# EAGLE schematic main_smd_first_draft (EAGLE 9.0.0)
AUTHOR: Mel McCalla; REV: 0.1

## Sheet 1 of 9: Microcontroller, Screen, JTAG, Reset, Encoder
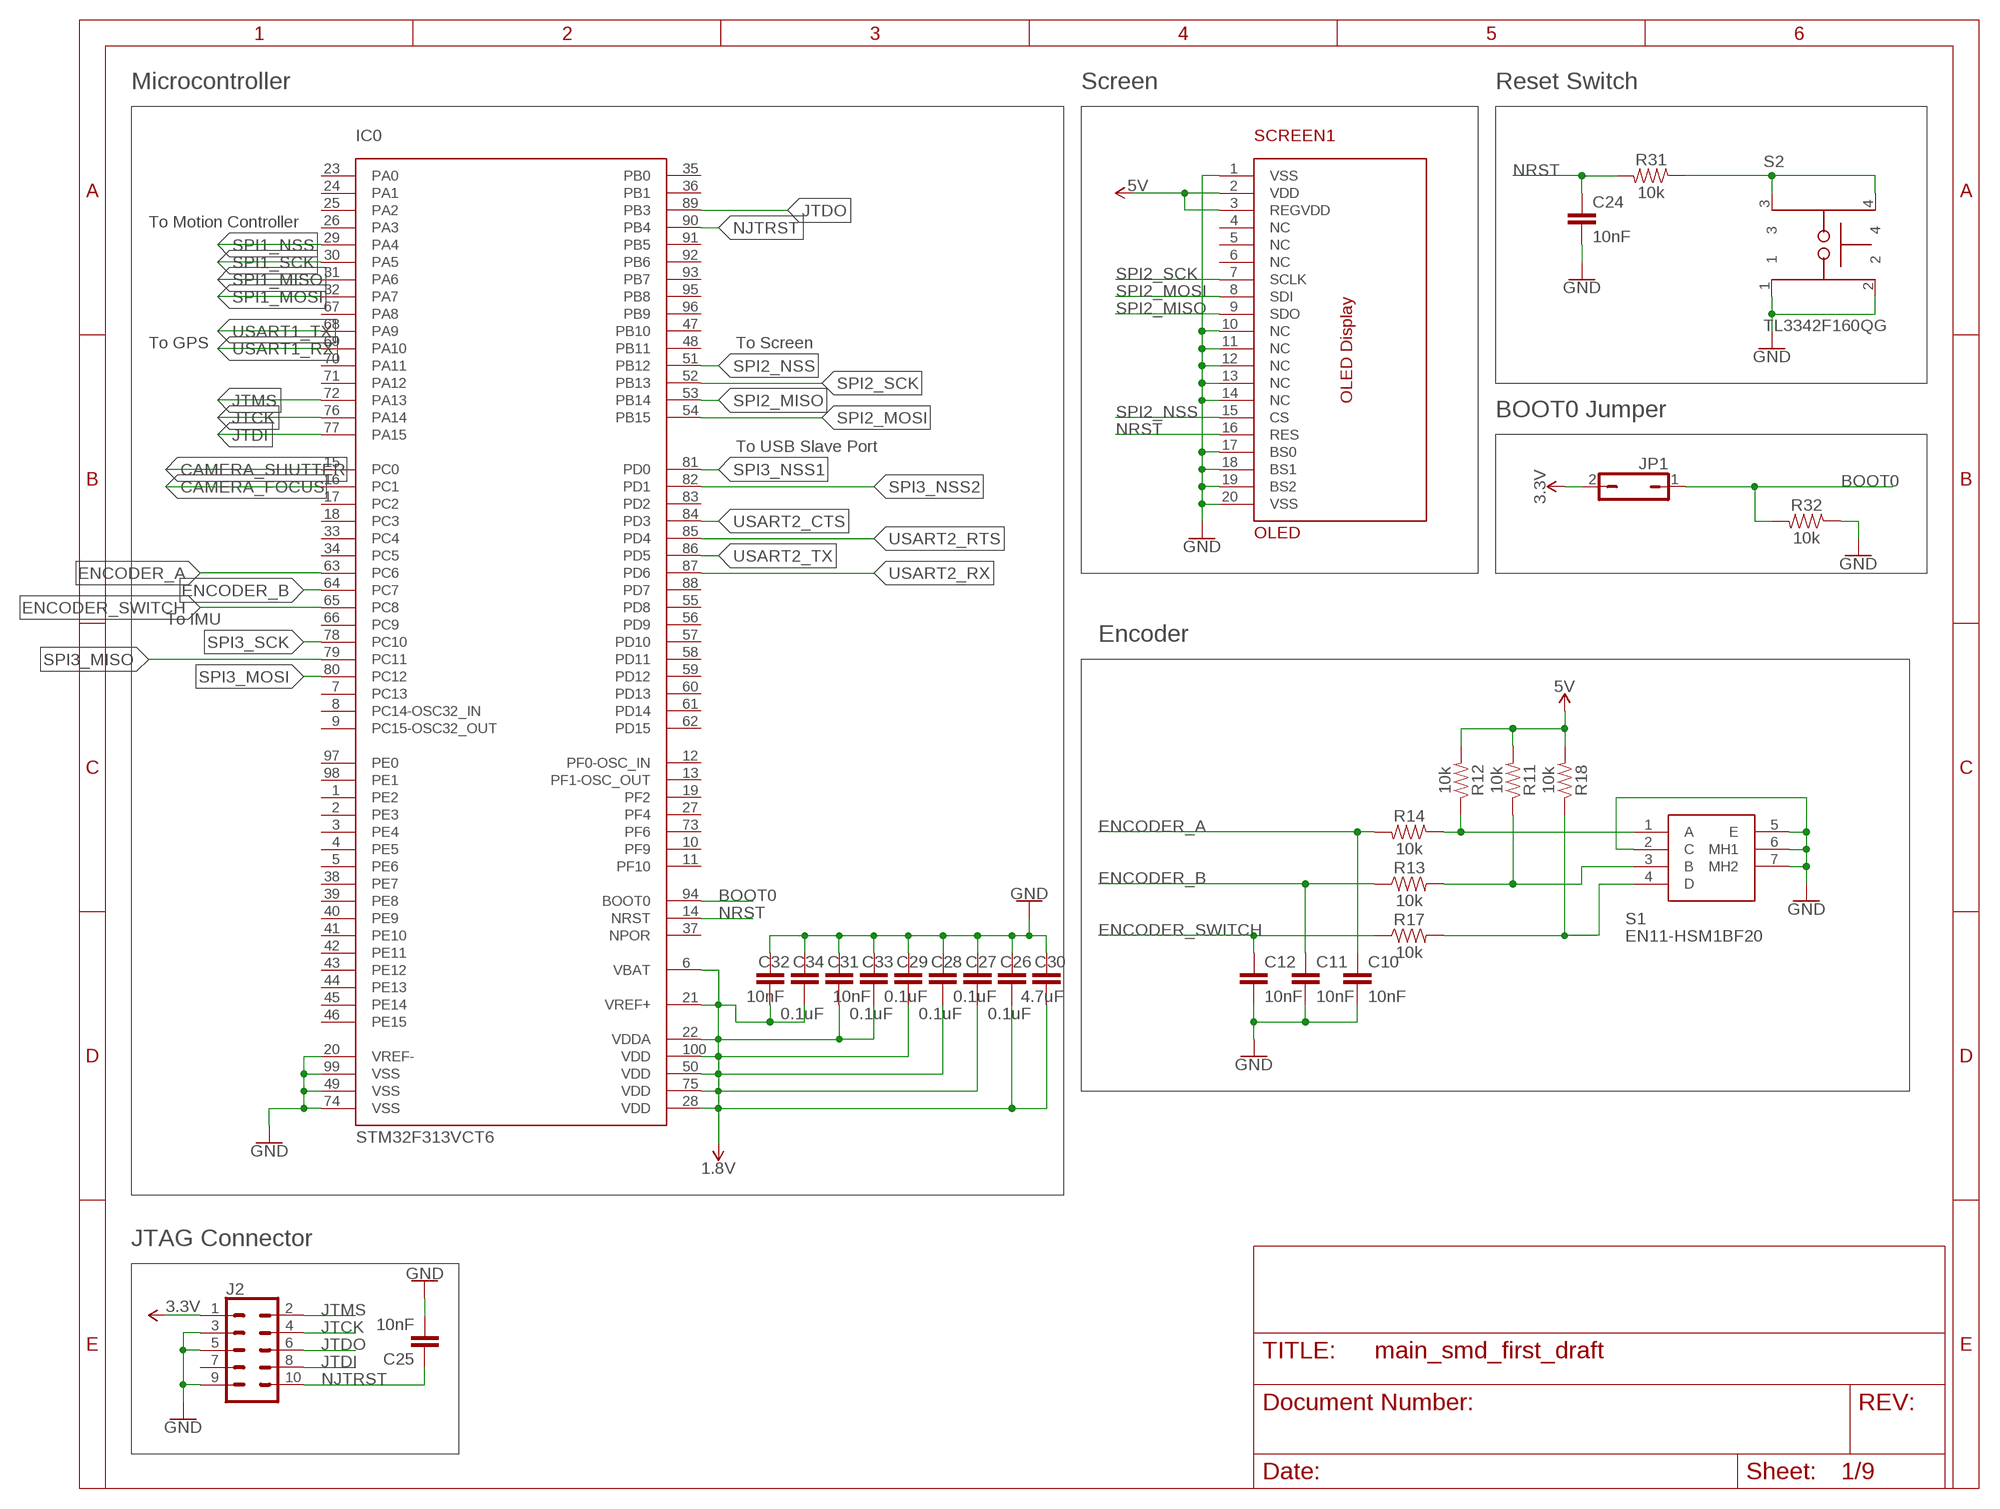
[diagram p0: schematic, sheet 1]

### Parts
C10  10nF  10NF-0603-50V-10%  [0603]
C11  10nF  10NF-0603-50V-10%  [0603]
C12  10nF  10NF-0603-50V-10%  [0603]
C24  10nF  10NF-0603-50V-10%  [0603]
C25  10nF  10NF-0603-50V-10%  [0603]
C26  0.1uF  0.1UF-0402-16V-10%  [0402]
C27  0.1uF  0.1UF-0402-16V-10%  [0402]
C28  0.1uF  0.1UF-0402-16V-10%  [0402]
C29  0.1uF  0.1UF-0402-16V-10%  [0402]
C30  4.7uF  4.7UF0603  [0603]
C31  10nF  10NF-0603-50V-10%  [0603]
C32  10nF  10NF-0603-50V-10%  [0603]
C33  0.1uF  0.1UF-0603-25V-(+80/-20%)  [0603]
C34  0.1uF  0.1UF-0603-25V-(+80/-20%)  [0603]
IC0  STM32F313VCT6  [QFP50P1600X1600X160-100N]
J2  CONN_05X2SHD_LOCK  [2X5-SHROUDED_LOCK]
JP1  JP1Q  [JP1]
R11  10k  10KOHM-0603-1/10W-1%  [0603]
R12  10k  10KOHM-0603-1/10W-1%  [0603]
R13  10k  10KOHM-0603-1/10W-1%  [0603]
R14  10k  10KOHM-0603-1/10W-1%  [0603]
R17  10k  10KOHM-0603-1/10W-1%  [0603]
R18  10k  10KOHM-0603-1/10W-1%  [0603]
R31  10k  10KOHM-0603-1/10W-1%  [0603]
R32  10k  10KOHM-0603-1/10W-1%  [0603]
S1  EN11-HSM1BF20  [EN11HSM1BF20]
S2  TL3342F160QG  [SW_TL3342F160QG]
SCREEN1  OLED  [SIP-20]

### Nets
1.8V [power]: C26.1 C27.1 C28.1 C29.1 C30.1 C31.2 C32.2 C33.2 C34.2 IC0.6(VBAT) IC0.21(VREF+) IC0.22(VDDA) IC0.28(VDD) IC0.50(VDD) IC0.75(VDD) IC0.100(VDD) ; also sheet 2,3
3.3V [power]: J2.1 JP1.2 ; also sheet 2,3,4,5,6,7,8,9
5V [power]: R11.2 R12.2 R18.2 SCREEN1.2(VDD) SCREEN1.3(REGVDD) ; also sheet 2,3,5,6,7,8
BOOT0: IC0.94(BOOT0) JP1.1 R32.2
CAMERA_FOCUS: IC0.16(PC1) ; also sheet 2
CAMERA_SHUTTER: IC0.15(PC0) ; also sheet 2
ENCODER_A: C10.1 IC0.63(PC6) R14.2
ENCODER_B: C11.1 IC0.64(PC7) R13.1
ENCODER_SWITCH: C12.1 IC0.65(PC8) R17.1
GND [ground]: C10.2 C11.2 C12.2 C24.2 C25.2 C26.2 C27.2 C28.2 C29.2 C30.2 C31.1 C32.1 C33.1 C34.1 IC0.20(VREF-) IC0.49(VSS) IC0.74(VSS) IC0.99(VSS) J2.3 J2.5 J2.9 R32.1 S1.2(C) S1.5(E) S1.6(MH1) S1.7(MH2) S2.1 S2.2 SCREEN1.1(VSS) SCREEN1.10(NC) SCREEN1.11(NC) SCREEN1.12(NC) SCREEN1.13(NC) SCREEN1.14(NC) SCREEN1.17(BS0) SCREEN1.18(BS1) SCREEN1.19(BS2) SCREEN1.20(VSS) ; also sheet 2,3,4,5,6,7,8,9
JTCK: IC0.76(PA14) J2.4
JTDI: IC0.77(PA15) J2.8
JTDO: IC0.89(PB3) J2.6
JTMS: IC0.72(PA13) J2.2
N$19: R17.2 R18.1 S1.4(D)
N$20: R12.1 R14.1 S1.1(A)
N$21: R11.1 R13.2 S1.3(B)
N$32: R31.1 S2.3 S2.4
NJTRST: C25.1 IC0.90(PB4) J2.10
NRST: C24.1 IC0.14(NRST) R31.2 SCREEN1.16(RES) ; also sheet 2,4
SPI1_MISO: IC0.31(PA6) ; also sheet 4
SPI1_MOSI: IC0.32(PA7) ; also sheet 4
SPI1_NSS: IC0.29(PA4) ; also sheet 4
SPI1_SCK: IC0.30(PA5) ; also sheet 4
SPI2_MISO: IC0.53(PB14) SCREEN1.9(SDO)
SPI2_MOSI: IC0.54(PB15) SCREEN1.8(SDI)
SPI2_NSS: IC0.51(PB12) SCREEN1.15(CS)
SPI2_SCK: IC0.52(PB13) SCREEN1.7(SCLK)
SPI3_MISO: IC0.79(PC11) ; also sheet 9
SPI3_MOSI: IC0.80(PC12) ; also sheet 9
SPI3_NSS1: IC0.81(PD0) ; also sheet 9
SPI3_NSS2: IC0.82(PD1) ; also sheet 9
SPI3_SCK: IC0.78(PC10) ; also sheet 9
USART1_RX: IC0.69(PA10) ; also sheet 9
USART1_TX: IC0.68(PA9) ; also sheet 9
USART2_CTS: IC0.84(PD3) ; also sheet 2
USART2_RTS: IC0.85(PD4) ; also sheet 2
USART2_RX: IC0.87(PD6) ; also sheet 2
USART2_TX: IC0.86(PD5) ; also sheet 2
Unconnected: IC0.1(PE2) IC0.2(PE3) IC0.3(PE4) IC0.4(PE5) IC0.5(PE6) IC0.7(PC13) IC0.8(PC14-OSC32_IN) IC0.9(PC15-OSC32_OUT) IC0.10(PF9) IC0.11(PF10) IC0.12(PF0-OSC_IN) IC0.13(PF1-OSC_OUT) IC0.17(PC2) IC0.18(PC3) IC0.19(PF2) IC0.23(PA0) IC0.24(PA1) IC0.25(PA2) IC0.26(PA3) IC0.27(PF4) IC0.33(PC4) IC0.34(PC5) IC0.35(PB0) IC0.36(PB1) IC0.37(NPOR) IC0.38(PE7) IC0.39(PE8) IC0.40(PE9) IC0.41(PE10) IC0.42(PE11) IC0.43(PE12) IC0.44(PE13) IC0.45(PE14) IC0.46(PE15) IC0.47(PB10) IC0.48(PB11) IC0.55(PD8) IC0.56(PD9) IC0.57(PD10) IC0.58(PD11) IC0.59(PD12) IC0.60(PD13) IC0.61(PD14) IC0.62(PD15) IC0.66(PC9) IC0.67(PA8) IC0.70(PA11) IC0.71(PA12) IC0.73(PF6) IC0.83(PD2) IC0.88(PD7) IC0.91(PB5) IC0.92(PB6) IC0.93(PB7) IC0.95(PB8) IC0.96(PB9) IC0.97(PE0) IC0.98(PE1) J2.7 SCREEN1.4(NC) SCREEN1.5(NC) SCREEN1.6(NC)

### Notes on the sheet
- Microcontroller | Screen | Reset Switch
- To Motion Controller
- To GPS | To Screen
- BOOT0 Jumper
- To USB Slave Port
- To IMU
- Encoder
- JTAG Connector

## Sheet 2 of 9: Camera Control, USB Controller, USB C Port
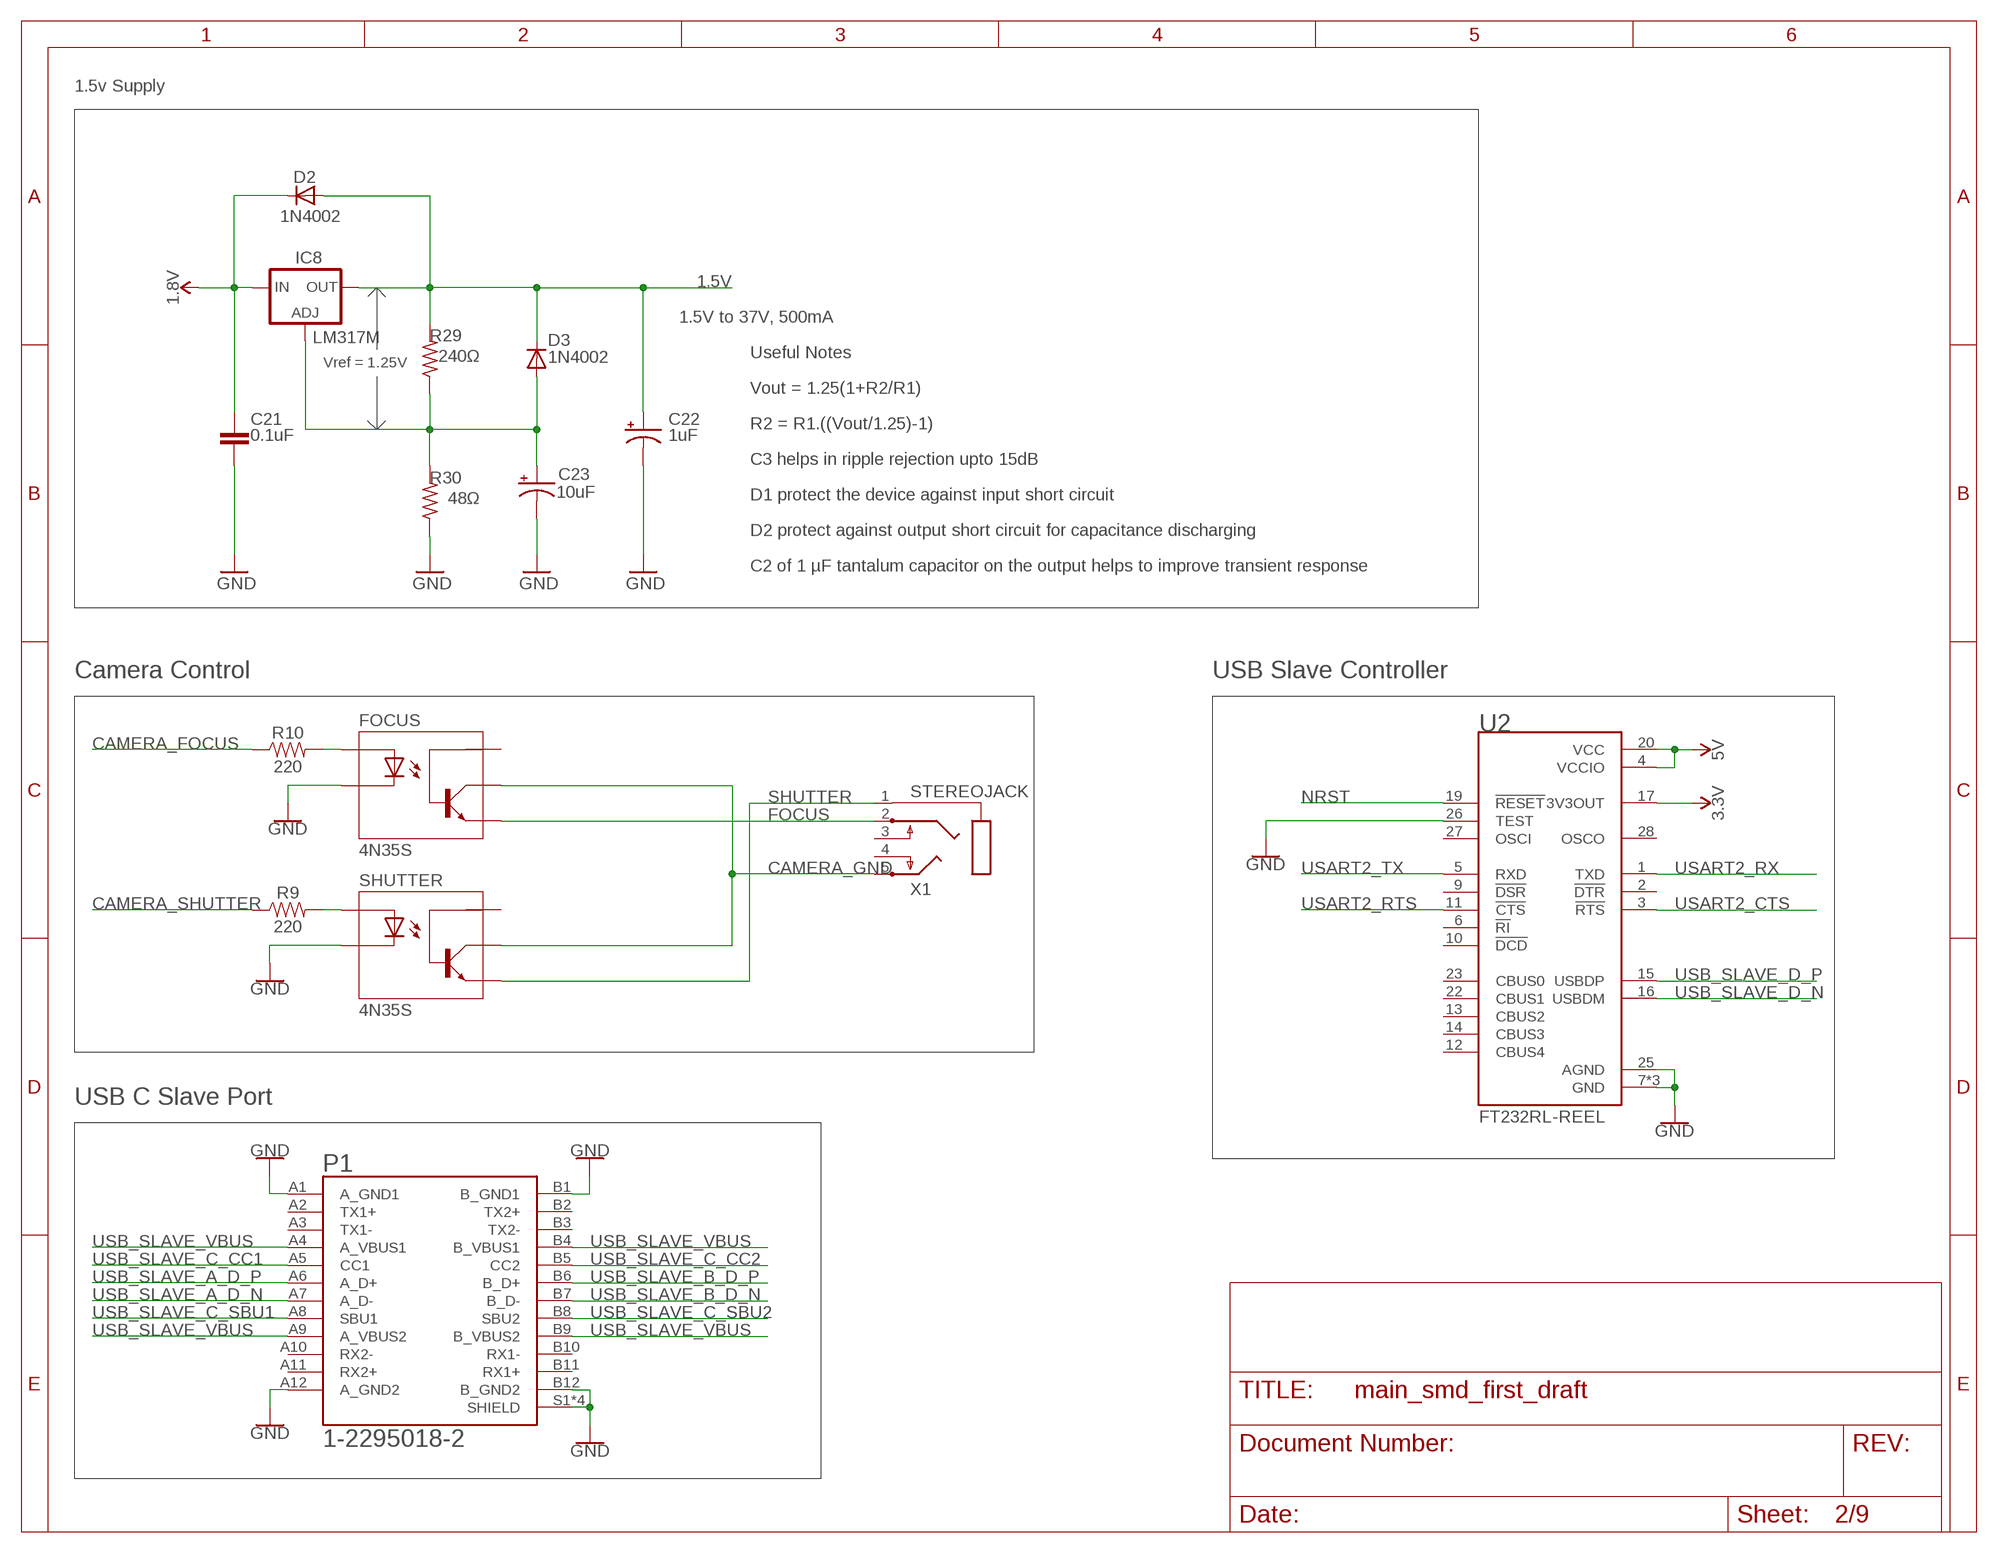
[diagram p1: schematic, sheet 2]

### Parts
C21  0.1uF  C-EU075-052X106  [C075-052X106]
C22  1uF  CPOL-US085CS-1AR  [085CS_1AR]
C23  10uF  CPOL-US085CS-1AR  [085CS_1AR]
D2  1N4002  1N4004  [DO41-10]
D3  1N4002  1N4004  [DO41-10]
FOCUS  4N35S  [SOT23-6]
IC8  LM317MBSTT3  [SOT223]
P1  1-2295018-2  [TE_1-2295018-2]
R9  220  220OHM-0603-1/10W-1%  [0603]
R10  220  220OHM-0603-1/10W-1%  [0603]
R29  240Ω  R-US_M0805  [M0805]
R30  48Ω  R-US_M0805  [M0805]
SHUTTER  4N35S  [SOT23-6]
U2  FT232RL-REEL  [SOP65P780X200-28N]
X1  STEREOJACK  [STX3100]

### Nets
1.5V: C22.+ D2.A D3.C IC8.4(OUT) R29.2 ; also sheet 4
1.8V [power]: C21.1 D2.C IC8.3(IN) ; also sheet 1,3
3.3V [power]: U2.17(3V3OUT) ; also sheet 1,3,4,5,6,7,8,9
5V [power]: U2.4(VCCIO) U2.20(VCC) ; also sheet 1,3,5,6,7,8
CAMERA_FOCUS: R10.1 ; also sheet 1
CAMERA_GND: FOCUS.5 SHUTTER.5 X1.5
CAMERA_SHUTTER: R9.1 ; also sheet 1
FOCUS: FOCUS.4 X1.2
GND [ground]: C21.2 C22.- C23.- FOCUS.2 P1.A1(A_GND1) P1.A12(A_GND2) P1.B1(B_GND1) P1.B12(B_GND2) P1.S1(SHIELD) P1.S2(SHIELD) P1.S3(SHIELD) P1.S4(SHIELD) R30.1 SHUTTER.2 U2.7(GND) U2.18(GND) U2.21(GND) U2.25(AGND) U2.26(TEST) ; also sheet 1,3,4,5,6,7,8,9
N$17: FOCUS.1 R10.2
N$18: R9.2 SHUTTER.1
N$30: C23.+ D3.A IC8.1(ADJ) R29.1 R30.2
NRST: U2.19(!RESET) ; also sheet 1,4
SHUTTER: SHUTTER.4 X1.1
USART2_CTS: U2.3(!RTS) ; also sheet 1
USART2_RTS: U2.11(!CTS) ; also sheet 1
USART2_RX: U2.1(TXD) ; also sheet 1
USART2_TX: U2.5(RXD) ; also sheet 1
USB_SLAVE_A_D_N [differential]: P1.A7(A_D-) ; also sheet 3
USB_SLAVE_A_D_P [differential]: P1.A6(A_D+) ; also sheet 3
USB_SLAVE_B_D_N [differential]: P1.B7(B_D-) ; also sheet 3
USB_SLAVE_B_D_P [differential]: P1.B6(B_D+) ; also sheet 3
USB_SLAVE_C_CC1: P1.A5(CC1) ; also sheet 3
USB_SLAVE_C_CC2: P1.B5(CC2) ; also sheet 3
USB_SLAVE_C_SBU1: P1.A8(SBU1) ; also sheet 3
USB_SLAVE_C_SBU2: P1.B8(SBU2) ; also sheet 3
USB_SLAVE_D_N [differential]: U2.16(USBDM) ; also sheet 3
USB_SLAVE_D_P [differential]: U2.15(USBDP) ; also sheet 3
USB_SLAVE_VBUS: P1.A4(A_VBUS1) P1.A9(A_VBUS2) P1.B4(B_VBUS1) P1.B9(B_VBUS2)
Unconnected: FOCUS.6 P1.A2(TX1+) P1.A3(TX1-) P1.A10(RX2-) P1.A11(RX2+) P1.B2(TX2+) P1.B3(TX2-) P1.B10(RX1-) P1.B11(RX1+) SHUTTER.6 U2.2(!DTR) U2.6(!RI) U2.9(!DSR) U2.10(!DCD) U2.12(CBUS4) U2.13(CBUS2) U2.14(CBUS3) U2.22(CBUS1) U2.23(CBUS0) U2.27(OSCI) U2.28(OSCO) X1.3 X1.4

### Notes on the sheet
- 1.5v Supply
- 1.5V to 37V, 500mA
- Useful Notes
- Vref = 1.25V
- Vout = 1.25(1+R2/R1)
- R2 = R1.((Vout/1.25)-1)
- C3 helps in ripple rejection upto 15dB
- D1 protect the device against input short circuit
- D2 protect against output short circuit for capacitance discharging
- C2 of 1 µF tantalum capacitor on the output helps to improve transient response
- Camera Control | USB Slave Controller
- USB C Slave Port

## Sheet 3 of 9: USB C Multiplexer, USB C ESD, Power Input
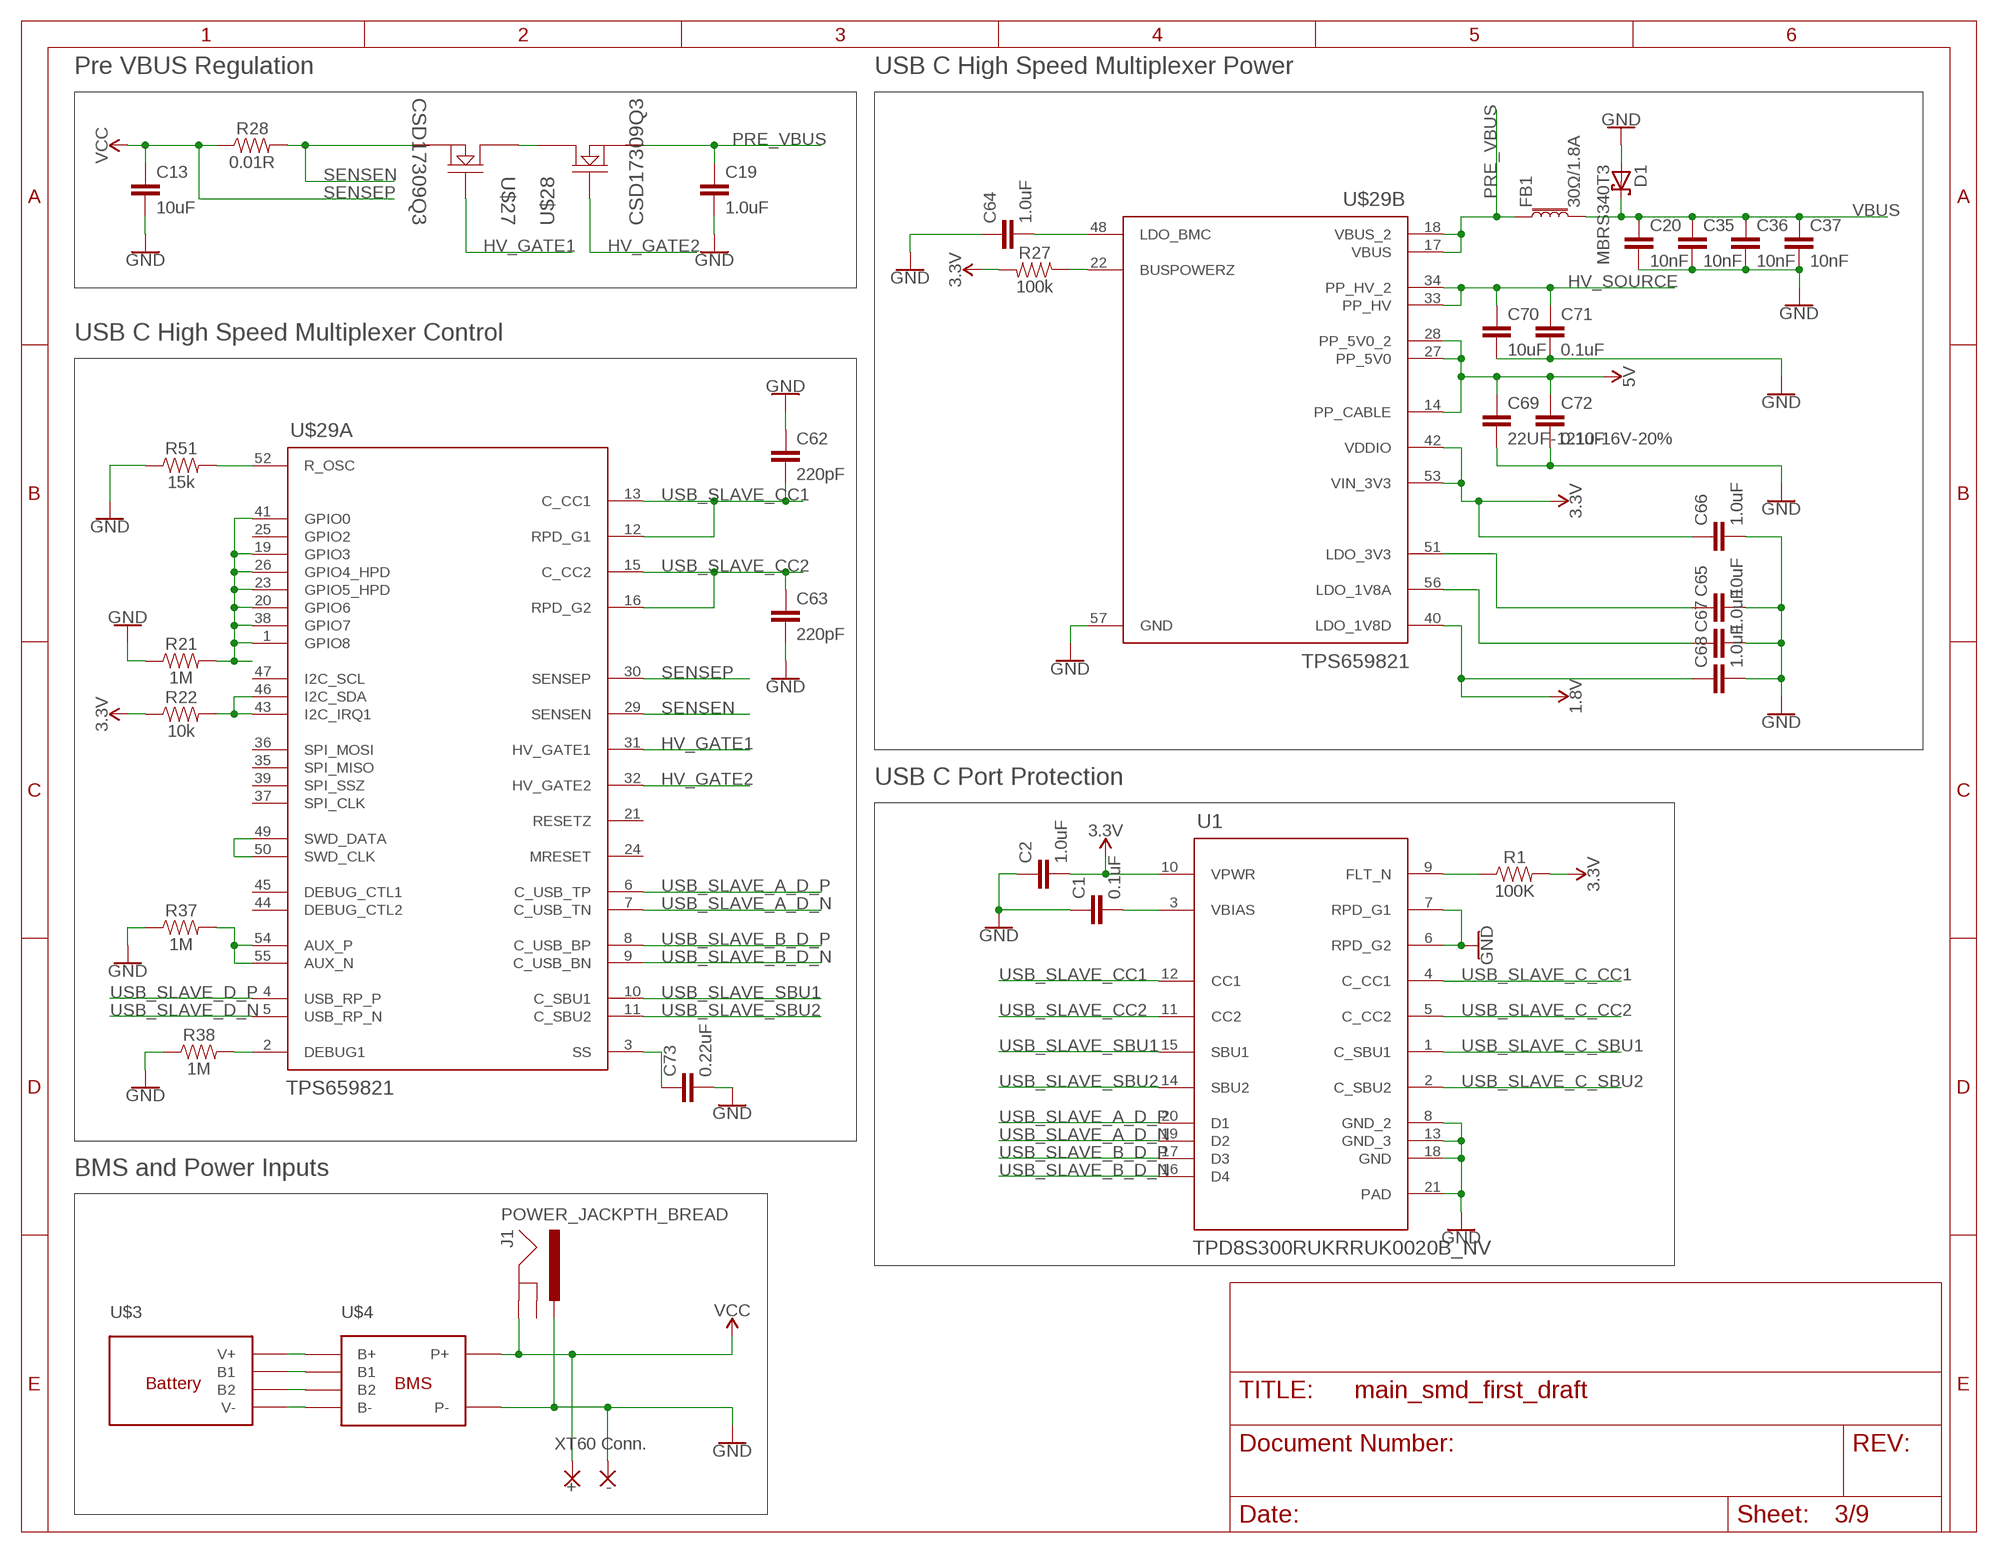
[diagram p2: schematic, sheet 3]

### Parts
+  3,81/1,1  [3,81/1,1]
-  3,81/1,1  [3,81/1,1]
C1  0.1uF  0.1UF-0603-100V-10%  [0603]
C2  1.0uF  1.0UF-0603-16V-10%  [0603]
C13  10uF  10UF-1210-50V-20%  [1210]
C19  1.0uF  1.0UF-1206-50V-10%  [1206]
C20  10nF  10NF-0603-50V-10%  [0603]
C35  10nF  10NF-0603-50V-10%  [0603]
C36  10nF  10NF-0603-50V-10%  [0603]
C37  10nF  10NF-0603-50V-10%  [0603]
C62  220pF  C-EUC0402  [C0402]
C63  220pF  C-EUC0402  [C0402]
C64  1.0uF  1.0UF-1206-50V-10%  [1206]
C65  10uF  10UF-1210-50V-20%  [1210]
C66  1.0uF  1.0UF-1206-50V-10%  [1206]
C67  1.0uF  1.0UF-1206-50V-10%  [1206]
C68  1.0uF  1.0UF-1206-50V-10%  [1206]
C69  22UF-1210-16V-20%  [1210]
C70  10uF  10UF-1210-50V-20%  [1210]
C71  0.1uF  0.1UF-0603-25V-5%  [0603]
C72  0.1uF  0.1UF-0603-25V-5%  [0603]
C73  0.22uF  0.22UF-0603-25V-10%  [0603]
D1  MBRS340T3  [SMC]
FB1  30Ω/1.8A  FERRITE_BEAD-0603  [0603]
J1  POWER_JACKPTH_BREAD  [POWER_JACK_PTH_BREAD]
R1  100K  100KOHM-0402-1/16W-1%  [0402]
R21  1M  1MOHM-0603-1/4W-5%  [0603]
R22  10k  10KOHM-0603-1/10W-1%  [0603]
R27  100k  100KOHM-0603-1/10W-1%  [0603]
R28  0.01R  RESISTOR0805  [0805]
R37  1M  1MOHM-0603-1/4W-5%  [0603]
R38  1M  1MOHM-0603-1/4W-5%  [0603]
R51  15k  15KOHM-0603-1/10W-1%  [0603]
U1  TPD8S300RUKRRUK0020B_NV  [RUK0020B_NV]
U$3  BATTERY  (no package)
U$4  BATTERY_MANAGEMENT_SYSTEM  (no package)
U$27  CSD17309Q3  [DQG0008A]
U$28  CSD17309Q3  [DQG0008A]
U$29  TPS659821  [QFN50P800X800X100-57N]

### Nets
1.8V [power]: C68.1 U$29.40(B:LDO_1V8D) ; also sheet 1,2
3.3V [power]: C2.2 C66.1 R1.2 R22.1 R27.2 U1.10(VPWR) U$29.42(B:VDDIO) U$29.53(B:VIN_3V3) ; also sheet 1,2,4,5,6,7,8,9
5V [power]: C69.1 C72.1 U$29.14(B:PP_CABLE) U$29.27(B:PP_5V0) U$29.28(B:PP_5V0_2) ; also sheet 1,2,5,6,7,8
GND [ground]: -.1(P) C1.1 C2.1 C13.2 C19.2 C20.2 C35.2 C36.2 C37.2 C62.1 C63.2 C64.1 C65.2 C66.2 C67.2 C68.2 C69.2 C70.2 C71.2 C72.2 C73.2 D1.A J1.PWR R21.1 R37.1 R38.1 R51.1 U1.6(RPD_G2) U1.7(RPD_G1) U1.8(GND_2) U1.13(GND_3) U1.18(GND) U1.21(PAD) U$4.P- U$29.57(B:GND) ; also sheet 1,2,4,5,6,7,8,9
HV_GATE1: U$27.4(GATE) U$29.31(A:HV_GATE1)
HV_GATE2: U$28.4(GATE) U$29.32(A:HV_GATE2)
HV_SOURCE [power]: C70.1 C71.1 U$29.33(B:PP_HV) U$29.34(B:PP_HV_2) ; also sheet 5
LDO_3V3 [power]: C65.1 U$29.51(B:LDO_3V3)
MEME: U$3.V+ U$4.B+
N$1: R37.2 U$29.54(A:AUX_P) U$29.55(A:AUX_N)
N$2: U$3.B1 U$4.B1
N$3: U$3.B2 U$4.B2
N$4 [power]: R27.1 U$29.22(B:BUSPOWERZ)
N$5 [power]: C64.2 U$29.48(B:LDO_BMC)
N$22: R21.2 U$29.1(A:GPIO8) U$29.19(A:GPIO3) U$29.20(A:GPIO6) U$29.23(A:GPIO5_HPD) U$29.26(A:GPIO4_HPD) U$29.38(A:GPIO7) U$29.41(A:GPIO0)
N$24: U$3.V- U$4.B-
N$28: U$27.5(DRAIN_2) U$27.6(DRAIN_2) U$27.7(DRAIN_2) U$27.8(DRAIN_2) U$28.5(DRAIN_2) U$28.6(DRAIN_2) U$28.7(DRAIN_2) U$28.8(DRAIN_2)
N$31: U$29.49(A:SWD_DATA) U$29.50(A:SWD_CLK)
N$34: R22.2 U$29.43(A:I2C_IRQ1) U$29.46(A:I2C_SDA)
N$35: R38.2 U$29.2(A:DEBUG1)
N$43: C73.1 U$29.3(A:SS)
N$45: R51.2 U$29.52(A:R_OSC)
N$52: C67.1 U$29.56(B:LDO_1V8A)
N$64 [power]: R1.1 U1.9(FLT_N)
N$66 [power]: C1.2 U1.3(VBIAS)
PRE_VBUS [power]: C19.1 FB1.1 U$28.1(SOURCE_2) U$28.2(SOURCE_2) U$28.3(SOURCE_2) U$29.17(B:VBUS) U$29.18(B:VBUS_2)
SENSEN: R28.2 U$27.1(SOURCE_2) U$27.2(SOURCE_2) U$27.3(SOURCE_2) U$29.29(A:SENSEN)
SENSEP [power]: C13.1 R28.1 U$29.30(A:SENSEP) ; supply symbol labelled VCC
USB_SLAVE_A_D_N [differential]: U1.19(D2) U$29.7(A:C_USB_TN) ; also sheet 2
USB_SLAVE_A_D_P [differential]: U1.20(D1) U$29.6(A:C_USB_TP) ; also sheet 2
USB_SLAVE_B_D_N [differential]: U1.16(D4) U$29.9(A:C_USB_BN) ; also sheet 2
USB_SLAVE_B_D_P [differential]: U1.17(D3) U$29.8(A:C_USB_BP) ; also sheet 2
USB_SLAVE_C_CC1: U1.4(C_CC1) ; also sheet 2
USB_SLAVE_C_CC2: U1.5(C_CC2) ; also sheet 2
USB_SLAVE_C_SBU1: U1.1(C_SBU1) ; also sheet 2
USB_SLAVE_C_SBU2: U1.2(C_SBU2) ; also sheet 2
USB_SLAVE_CC1: C62.2 U1.12(CC1) U$29.12(A:RPD_G1) U$29.13(A:C_CC1)
USB_SLAVE_CC2: C63.1 U1.11(CC2) U$29.15(A:C_CC2) U$29.16(A:RPD_G2)
USB_SLAVE_D_N [differential]: U$29.5(A:USB_RP_N) ; also sheet 2
USB_SLAVE_D_P [differential]: U$29.4(A:USB_RP_P) ; also sheet 2
USB_SLAVE_SBU1: U1.15(SBU1) U$29.10(A:C_SBU1)
USB_SLAVE_SBU2: U1.14(SBU2) U$29.11(A:C_SBU2)
VBUS: C20.1 C35.1 C36.1 C37.1 D1.C FB1.2
VCC: +.1(P) J1.GND U$4.P+ ; also sheet 5,6,7,8
Unconnected: J1.GNDBREAK U$29.21(A:RESETZ) U$29.24(A:MRESET) U$29.25(A:GPIO2) U$29.35(A:SPI_MISO) U$29.36(A:SPI_MOSI) U$29.37(A:SPI_CLK) U$29.39(A:SPI_SSZ) U$29.44(A:DEBUG_CTL2) U$29.45(A:DEBUG_CTL1) U$29.47(A:I2C_SCL)

### Notes on the sheet
- Pre VBUS Regulation | USB C High Speed Multiplexer Power
- USB C High Speed Multiplexer Control
- USB C Port Protection
- BMS and Power Inputs
- XT60 Conn.

## Sheet 4 of 9: Motion Control
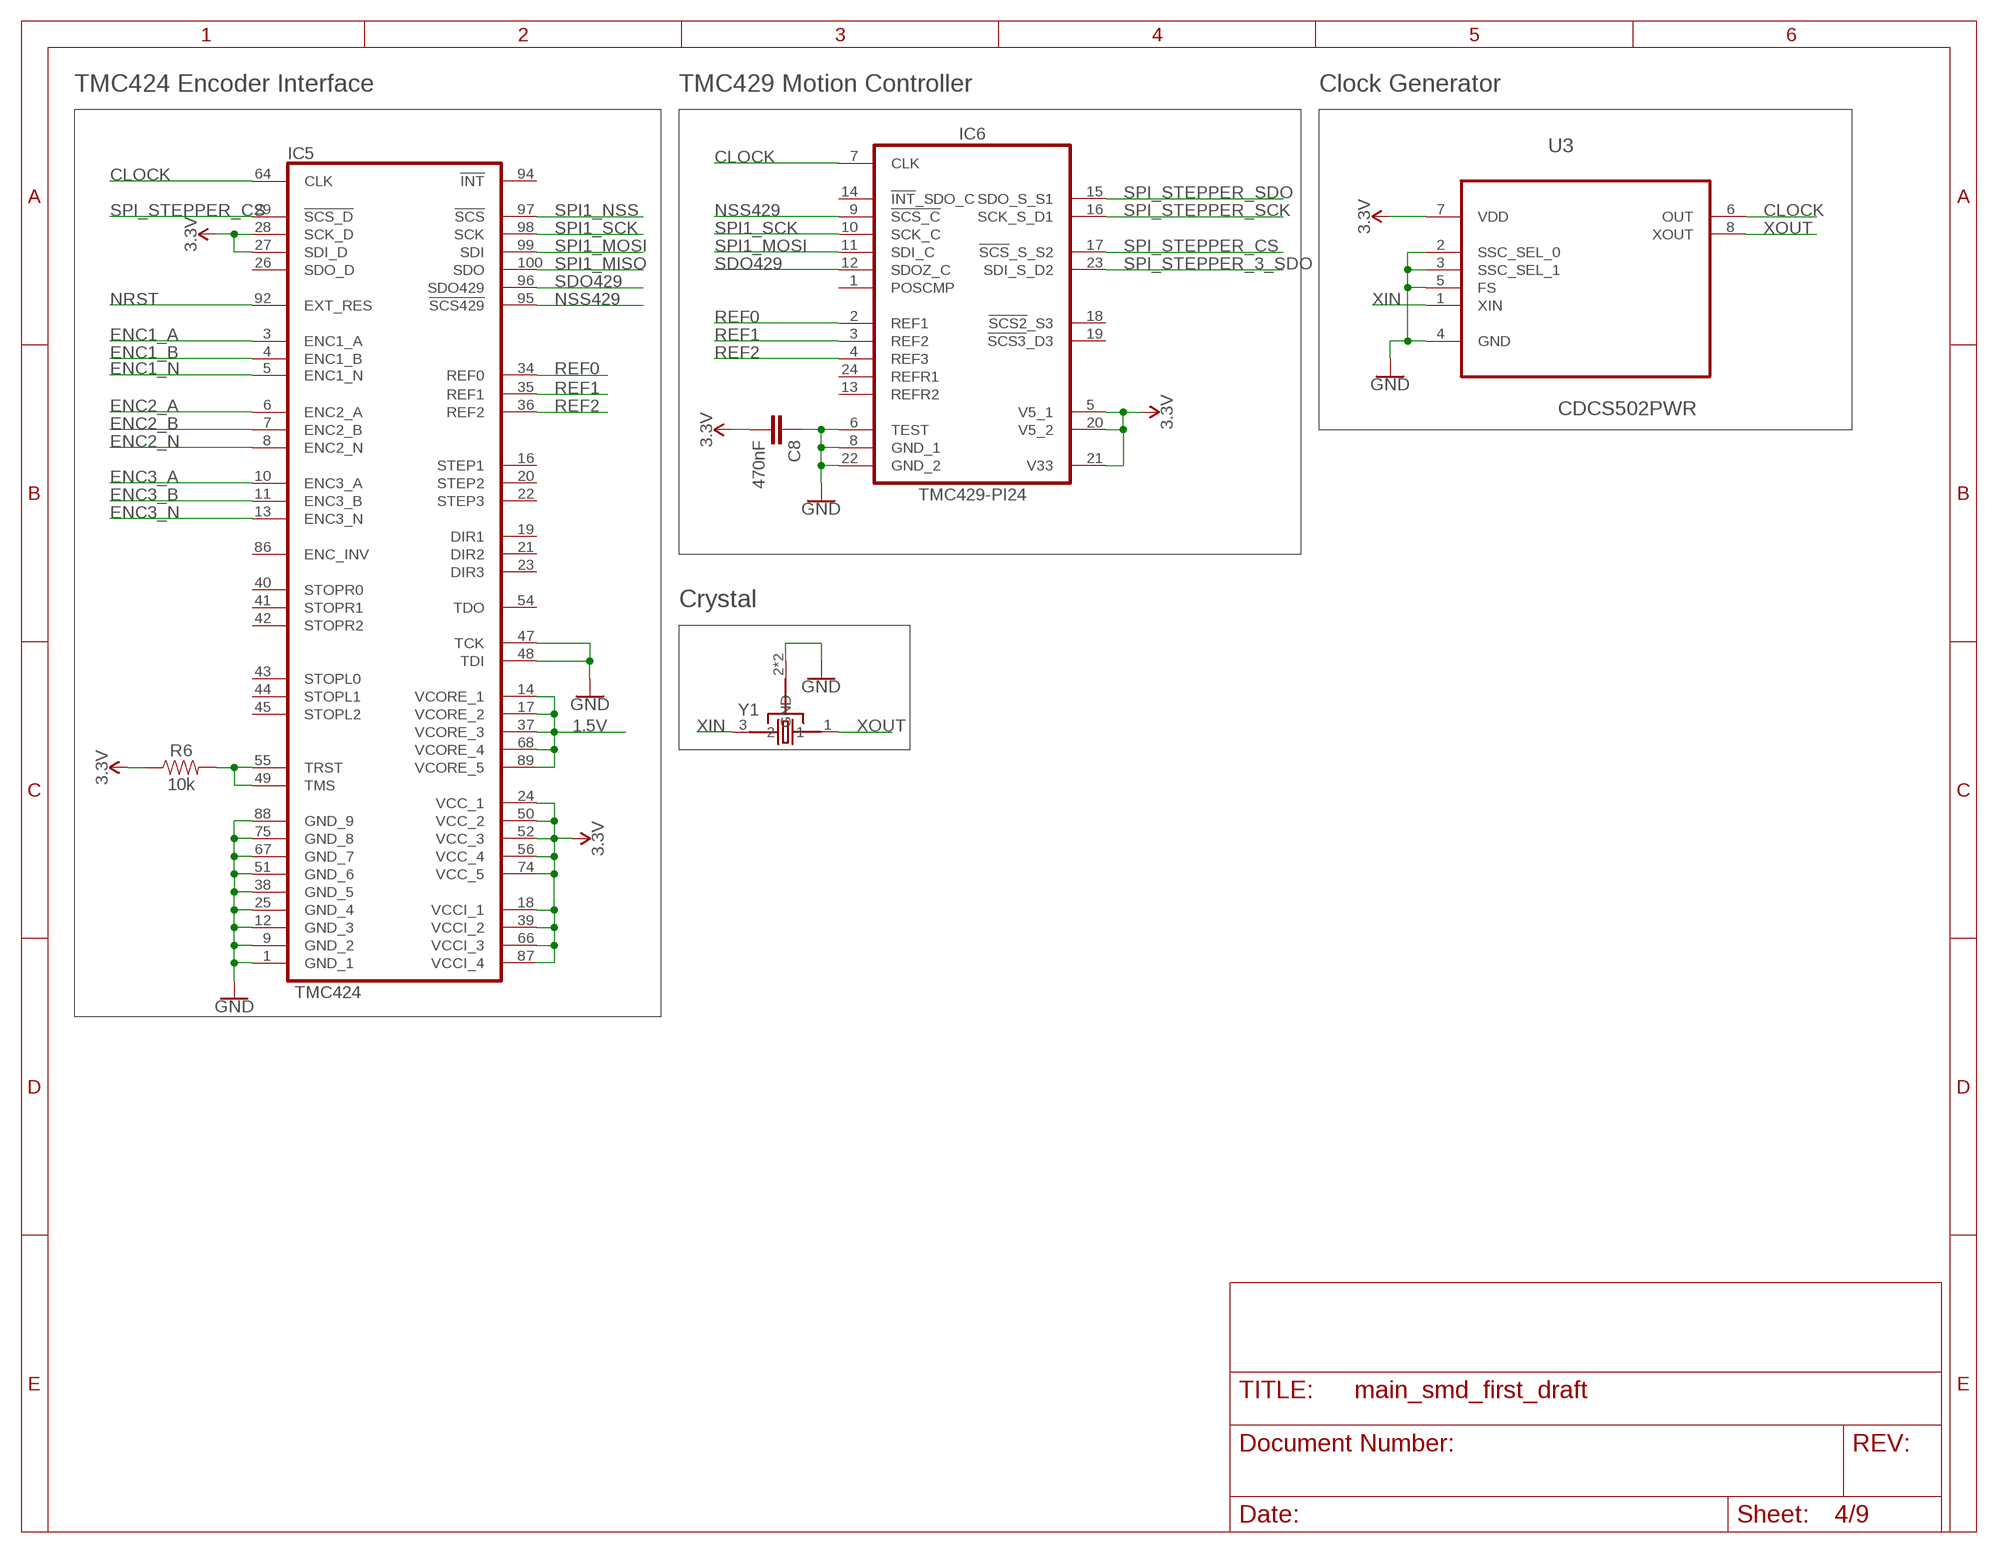
[diagram p3: schematic, sheet 4]

### Parts
C8  470nF  470NF-0402-16V-10%  [0402]
IC5  TMC424  TMC424  [TMC_TQFP100_0.5_14X14]
IC6  TMC429-PI24  TMC429-PI24  [TMC_SO24_SOT137-1_1.27_15.5X7.5]
R6  10k  10KOHM-0603-1/10W-1%  [0603]
U3  CDCS502PWR  [SOP65P640X120-8N]
Y1  7B-16.000MAAJ-T  [7B-16.000MAAJ-T_OSCSC500X320X105-4N]

### Nets
1.5V: IC5.14(VCORE_1) IC5.17(VCORE_2) IC5.37(VCORE_3) IC5.68(VCORE_4) IC5.89(VCORE_5) ; also sheet 2
3.3V [power]: C8.2 IC5.18(VCCI_1) IC5.24(VCC_1) IC5.27(SDI_D) IC5.28(SCK_D) IC5.39(VCCI_2) IC5.50(VCC_2) IC5.52(VCC_3) IC5.56(VCC_4) IC5.66(VCCI_3) IC5.74(VCC_5) IC5.87(VCCI_4) IC6.5(V5_1) IC6.20(V5_2) IC6.21(V33) R6.1 U3.7(VDD) ; also sheet 1,2,3,5,6,7,8,9
CLOCK: IC5.64(CLK) IC6.7(CLK) U3.6(OUT) ; also sheet 6,7,8
ENC1_A: IC5.3(ENC1_A) ; also sheet 6
ENC1_B: IC5.4(ENC1_B) ; also sheet 6
ENC1_N: IC5.5(ENC1_N) ; also sheet 6
ENC2_A: IC5.6(ENC2_A) ; also sheet 7
ENC2_B: IC5.7(ENC2_B) ; also sheet 7
ENC2_N: IC5.8(ENC2_N) ; also sheet 7
ENC3_A: IC5.10(ENC3_A) ; also sheet 8
ENC3_B: IC5.11(ENC3_B) ; also sheet 8
ENC3_N: IC5.13(ENC3_N) ; also sheet 8
GND [ground]: C8.1 IC5.1(GND_1) IC5.9(GND_2) IC5.12(GND_3) IC5.25(GND_4) IC5.38(GND_5) IC5.47(TCK) IC5.48(TDI) IC5.51(GND_6) IC5.67(GND_7) IC5.75(GND_8) IC5.88(GND_9) IC6.6(TEST) IC6.8(GND_1) IC6.22(GND_2) U3.2(SSC_SEL_0) U3.3(SSC_SEL_1) U3.4(GND) U3.5(FS) Y1.2(GND) Y1.4(GND) ; also sheet 1,2,3,5,6,7,8,9
N$25: IC5.49(TMS) IC5.55(TRST) R6.2
NRST: IC5.92(EXT_RES) ; also sheet 1,2
NSS429: IC5.95(!SCS429) IC6.9(!SCS_C)
REF0: IC5.34(REF0) IC6.2(REF1)
REF1: IC5.35(REF1) IC6.3(REF2)
REF2: IC5.36(REF2) IC6.4(REF3)
SDO429: IC5.96(SDO429) IC6.12(SDOZ_C)
SPI1_MISO: IC5.100(SDO) ; also sheet 1
SPI1_MOSI: IC5.99(SDI) IC6.11(SDI_C) ; also sheet 1
SPI1_NSS: IC5.97(!SCS) ; also sheet 1
SPI1_SCK: IC5.98(SCK) IC6.10(SCK_C) ; also sheet 1
SPI_STEPPER_3_SDO: IC6.23(SDI_S_D2) ; also sheet 8
SPI_STEPPER_CS: IC5.29(!SCS_D) IC6.17(!SCS!_S_S2) ; also sheet 6,7,8
SPI_STEPPER_SCK: IC6.16(SCK_S_D1) ; also sheet 6,7,8
SPI_STEPPER_SDO: IC6.15(SDO_S_S1) ; also sheet 6
XIN: U3.1(XIN) Y1.3
XOUT: U3.8(XOUT) Y1.1
Unconnected: IC5.16(STEP1) IC5.19(DIR1) IC5.20(STEP2) IC5.21(DIR2) IC5.22(STEP3) IC5.23(DIR3) IC5.26(SDO_D) IC5.40(STOPR0) IC5.41(STOPR1) IC5.42(STOPR2) IC5.43(STOPL0) IC5.44(STOPL1) IC5.45(STOPL2) IC5.54(TDO) IC5.86(ENC_INV) IC5.94(!INT) IC6.1(POSCMP) IC6.13(REFR2) IC6.14(!INT!_SDO_C) IC6.18(!SCS2!_S3) IC6.19(!SCS3!_D3) IC6.24(REFR1)

### Notes on the sheet
- TMC424 Encoder Interface | TMC429 Motion Controller | Clock Generator
- Crystal

## Sheet 5 of 9: Power Supply
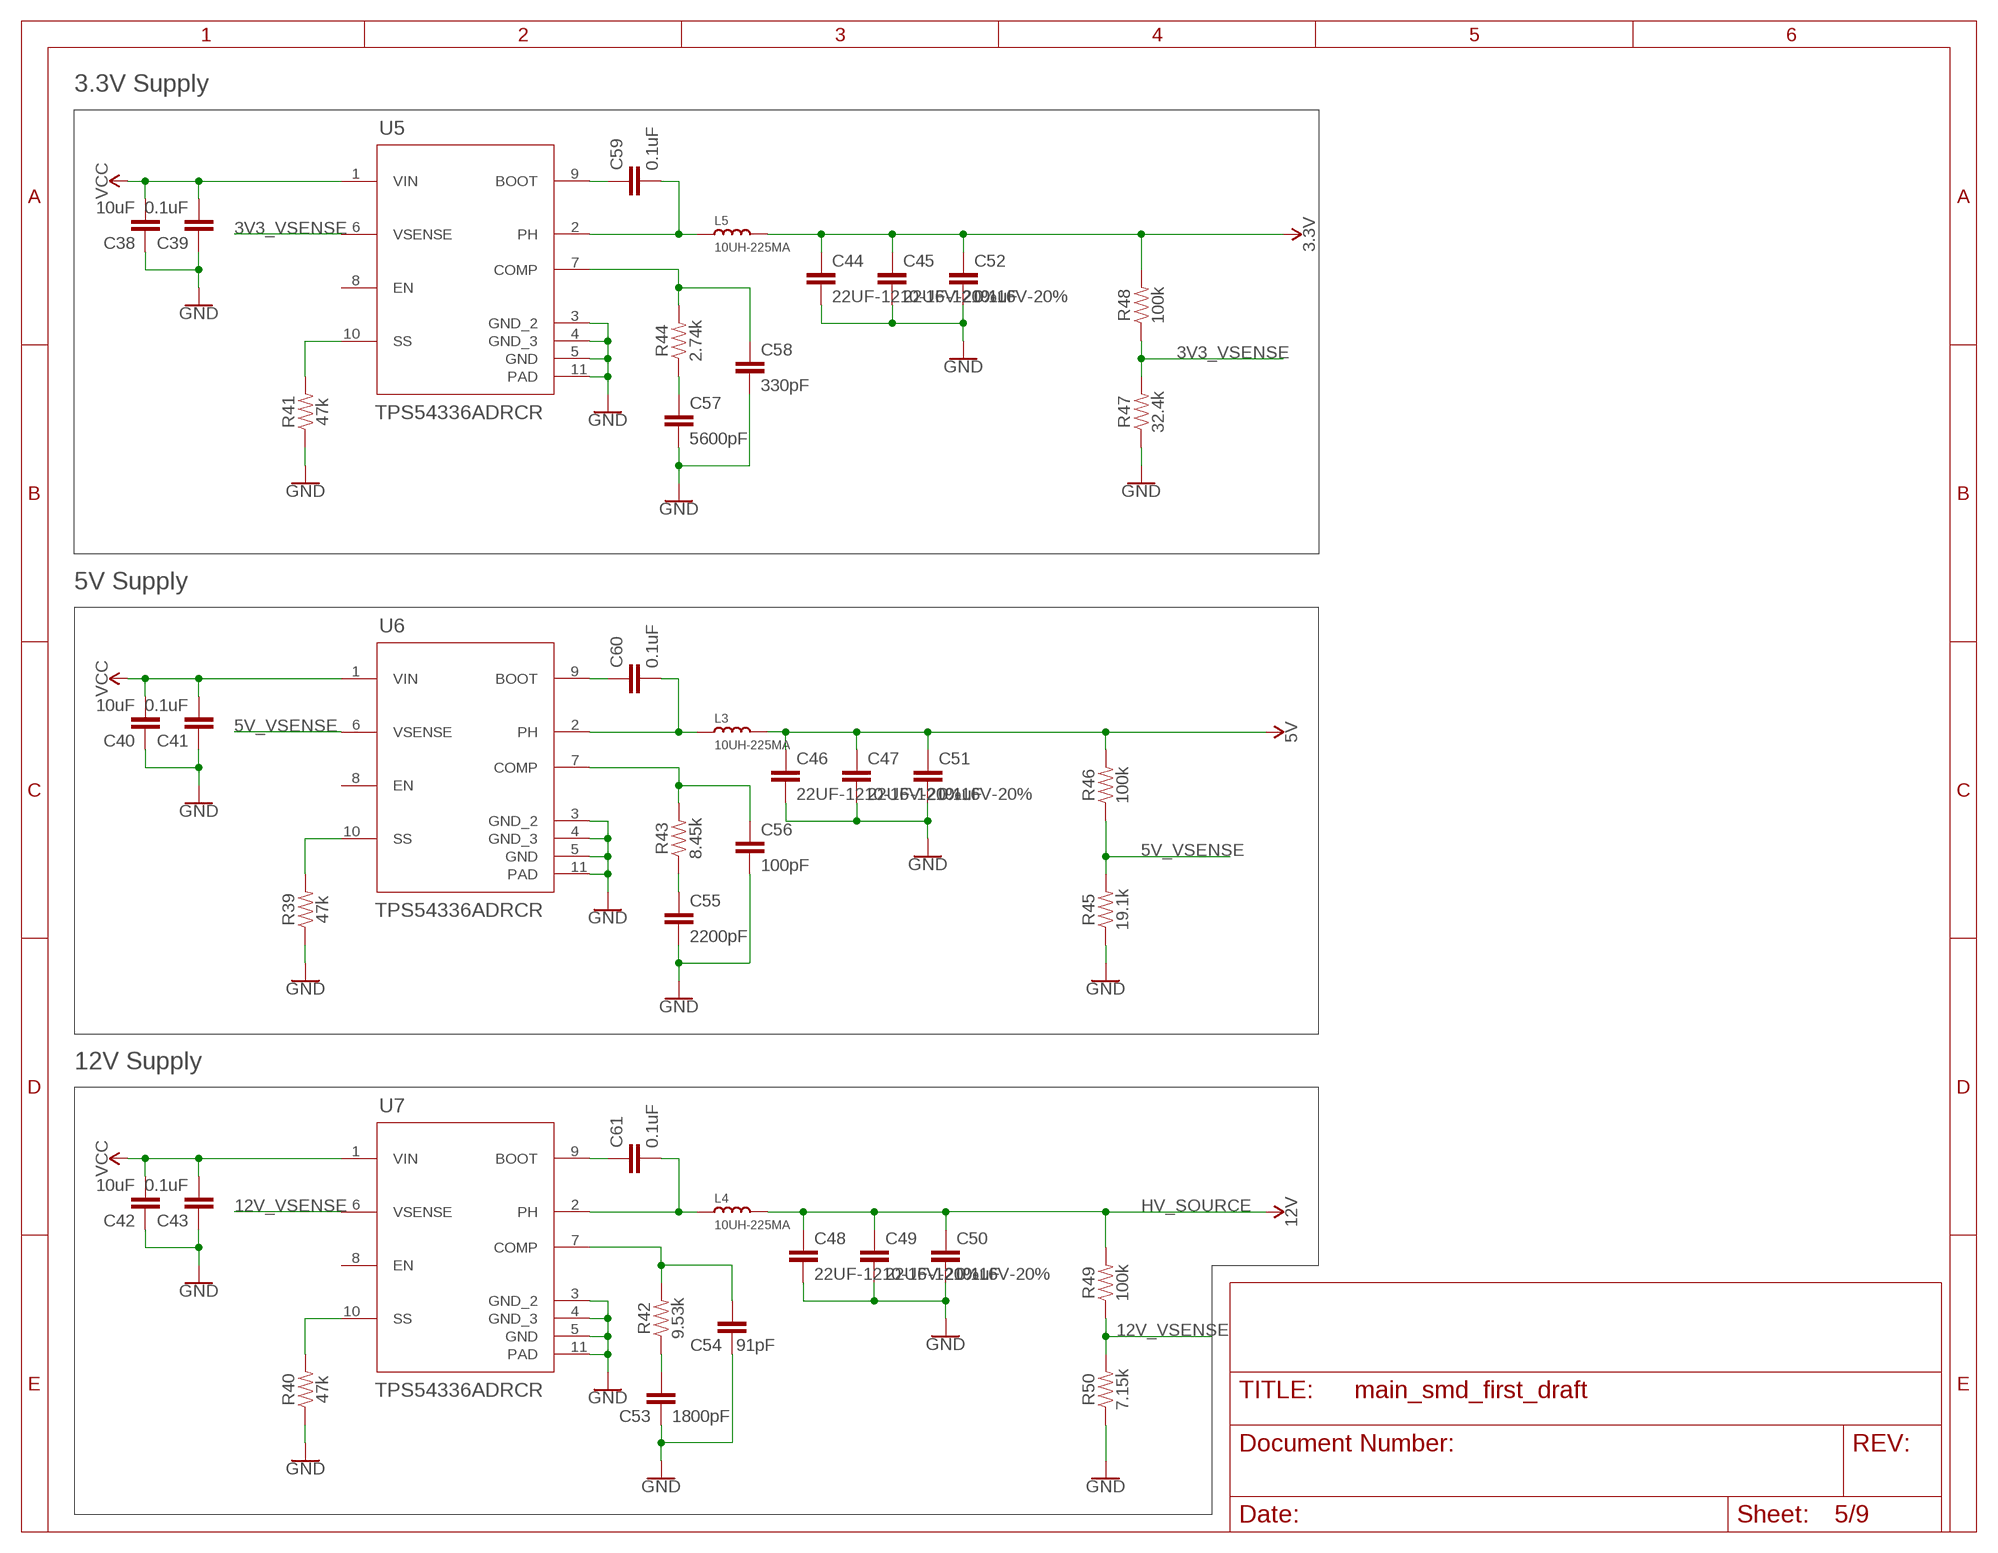
[diagram p4: schematic, sheet 5]

### Parts
C38  10uF  10UF-1210-50V-20%  [1210]
C39  0.1uF  0.1UF-0603-100V-10%  [0603]
C40  10uF  10UF-1210-50V-20%  [1210]
C41  0.1uF  0.1UF-0603-100V-10%  [0603]
C42  10uF  10UF-1210-50V-20%  [1210]
C43  0.1uF  0.1UF-0603-100V-10%  [0603]
C44  22UF-1210-16V-20%  [1210]
C45  22UF-1210-16V-20%  [1210]
C46  22UF-1210-16V-20%  [1210]
C47  22UF-1210-16V-20%  [1210]
C48  22UF-1210-16V-20%  [1210]
C49  22UF-1210-16V-20%  [1210]
C50  0.1uF  0.1UF-0402-16V-10%  [0402]
C51  0.1uF  0.1UF-0402-16V-10%  [0402]
C52  0.1uF  0.1UF-0402-16V-10%  [0402]
C53  1800pF  C-EUC0402  [C0402]
C54  91pF  C-EUC0402  [C0402]
C55  2200pF  C-EUC0402  [C0402]
C56  100pF  C-EUC0402  [C0402]
C57  5600pF  C-EUC0402  [C0402]
C58  330pF  C-EUC0402  [C0402]
C59  0.1uF  0.1UF-0603-25V-5%  [0603]
C60  0.1uF  0.1UF-0603-25V-5%  [0603]
C61  0.1uF  0.1UF-0603-25V-5%  [0603]
L3  10UH-225MA  SMD-INDUCTOR-10UH-225MA-10%(0806)  [L0806]
L4  10UH-225MA  SMD-INDUCTOR-10UH-225MA-10%(0806)  [L0806]
L5  10UH-225MA  SMD-INDUCTOR-10UH-225MA-10%(0806)  [L0806]
R39  47k  47KOHM-0603-1/10W-1%  [0603]
R40  47k  47KOHM-0603-1/10W-1%  [0603]
R41  47k  47KOHM-0603-1/10W-1%  [0603]
R42  9.53k  RESISTOR0603  [0603]
R43  8.45k  RESISTOR0603  [0603]
R44  2.74k  RESISTOR0603  [0603]
R45  19.1k  RESISTOR0603  [0603]
R46  100k  RESISTOR0603  [0603]
R47  32.4k  RESISTOR0603  [0603]
R48  100k  RESISTOR0603  [0603]
R49  100k  RESISTOR0603  [0603]
R50  7.15k  RESISTOR0603  [0603]
U5  TPS54336ADRCR  [DRC0010J]
U6  TPS54336ADRCR  [DRC0010J]
U7  TPS54336ADRCR  [DRC0010J]

### Nets
3.3V [power]: C44.1 C45.1 C52.1 L5.2 R48.2 ; also sheet 1,2,3,4,6,7,8,9
3V3_VSENSE: R47.2 R48.1 U5.6(VSENSE)
5V [power]: C46.1 C47.1 C51.1 L3.2 R46.2 ; also sheet 1,2,3,6,7,8
5V_VSENSE: R45.2 R46.1 U6.6(VSENSE)
12V_VSENSE: R49.1 R50.2 U7.6(VSENSE)
GND [ground]: C38.1 C39.1 C40.1 C41.1 C42.1 C43.1 C44.2 C45.2 C46.2 C47.2 C48.2 C49.2 C50.2 C51.2 C52.2 C53.1 C54.1 C55.2 C56.2 C57.2 C58.2 R39.1 R40.1 R41.1 R45.1 R47.1 R50.1 U5.3(GND_2) U5.4(GND_3) U5.5(GND) U5.11(PAD) U6.3(GND_2) U6.4(GND_3) U6.5(GND) U6.11(PAD) U7.3(GND_2) U7.4(GND_3) U7.5(GND) U7.11(PAD) ; also sheet 1,2,3,4,6,7,8,9
HV_SOURCE [power]: C48.1 C49.1 C50.1 L4.2 R49.2 ; supply symbol labelled 12V ; also sheet 3
N$39: R41.2 U5.10(SS)
N$40: R39.2 U6.10(SS)
N$41: R40.2 U7.10(SS)
N$42: C61.2 L4.1 U7.2(PH)
N$44: C60.2 L3.1 U6.2(PH)
N$48: C59.2 L5.1 U5.2(PH)
N$49: C61.1 U7.9(BOOT)
N$50: C59.1 U5.9(BOOT)
N$53: C60.1 U6.9(BOOT)
N$54: C53.2 R42.1
N$57: C54.2 R42.2 U7.7(COMP)
N$58: C55.1 R43.1
N$59: C56.1 R43.2 U6.7(COMP)
N$62: C57.1 R44.1
N$63: C58.1 R44.2 U5.7(COMP)
VCC: C38.2 C39.2 C40.2 C41.2 C42.2 C43.2 U5.1(VIN) U6.1(VIN) U7.1(VIN) ; also sheet 3,6,7,8
Unconnected: U5.8(EN) U6.8(EN) U7.8(EN)

### Notes on the sheet
- 3.3V Supply
- 5V Supply
- 12V Supply

## Sheet 6 of 9: Stepper 1
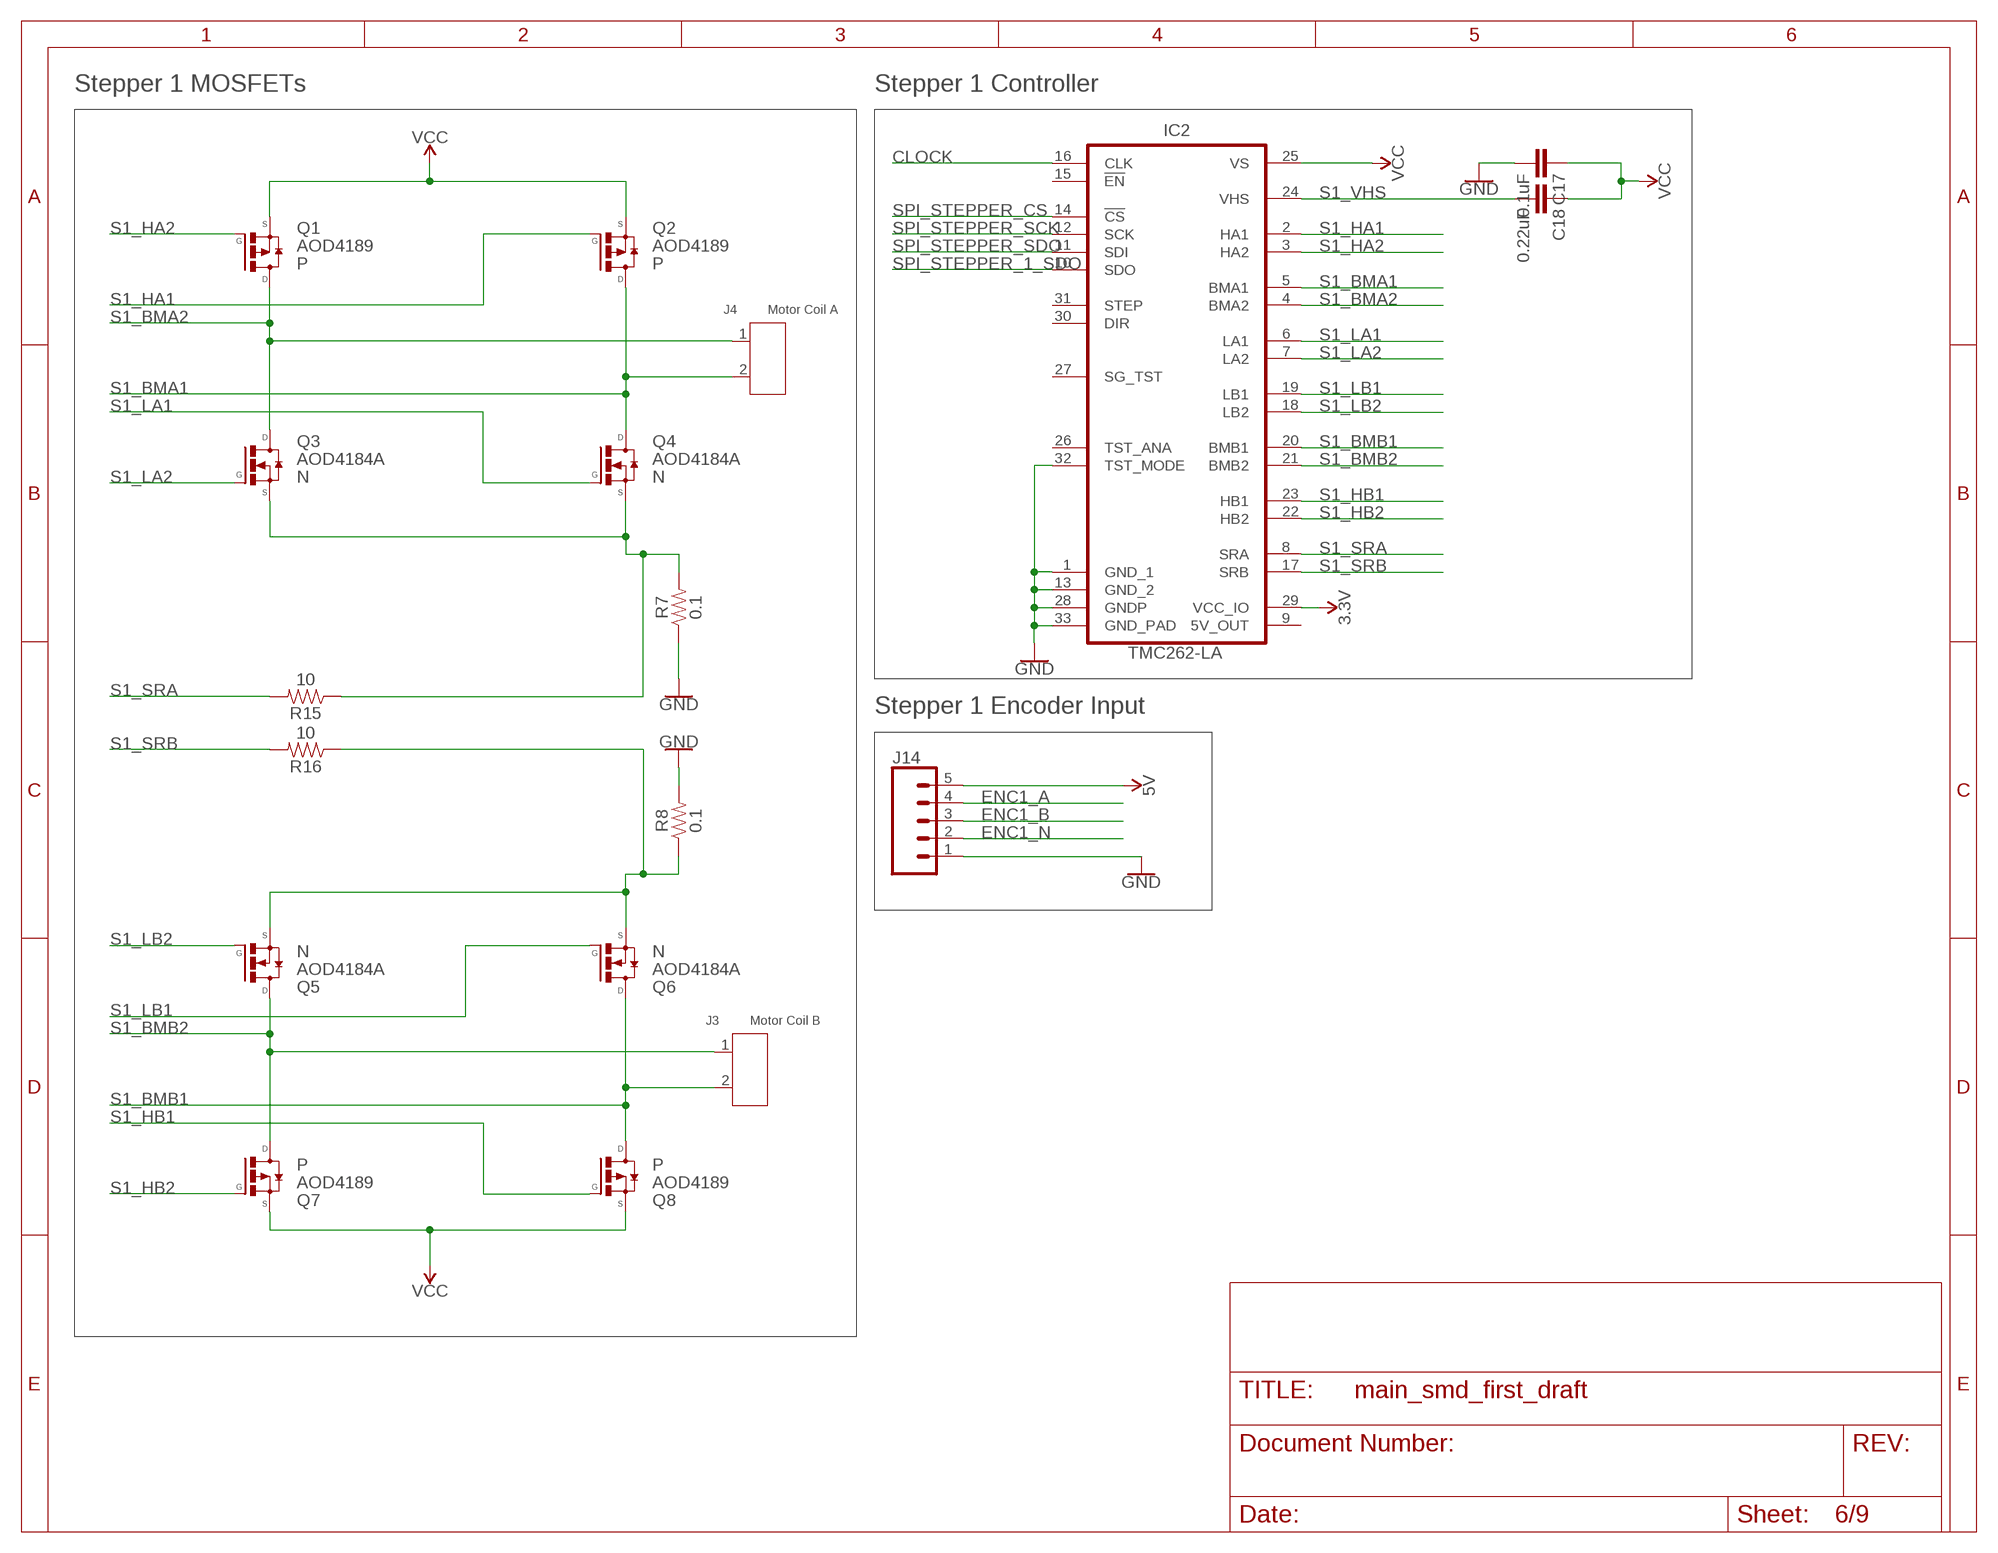
[diagram p5: schematic, sheet 6]

### Parts
C17  0.1uF  0.1UF-0402-16V-10%  [0402]
C18  0.22uF  0.22UF-0603-25V-10%  [0603]
IC2  TMC262-LA  TMC262-LA  [TMC_QFN32_0.5_5.0X5.0]
J3  Motor Coil B  SCREW-TERMINAL-GREEN(2P-5.0)  [H2-5.0-10.5X8.0MM]
J4  Motor Coil A  SCREW-TERMINAL-GREEN(2P-5.0)  [H2-5.0-10.5X8.0MM]
J14  CONN_05  [1X05]
Q1  AOD4189  [TO252]
Q2  AOD4189  [TO252]
Q3  AOD4184A  [TO252]
Q4  AOD4184A  [TO252]
Q5  AOD4184A  [TO252]
Q6  AOD4184A  [TO252]
Q7  AOD4189  [TO252]
Q8  AOD4189  [TO252]
R7  0.1  0.1OHM-1210-1/2W-1%  [1210]
R8  0.1  0.1OHM-1210-1/2W-1%  [1210]
R15  10  10OHM-1206-1/4W-1%  [1206]
R16  10  10OHM-1206-1/4W-1%  [1206]

### Nets
3.3V [power]: IC2.29(VCC_IO) ; also sheet 1,2,3,4,5,7,8,9
5V [power]: J14.5 ; also sheet 1,2,3,5,7,8
CLOCK: IC2.16(CLK) ; also sheet 4,7,8
ENC1_A: J14.4 ; also sheet 4
ENC1_B: J14.3 ; also sheet 4
ENC1_N: J14.2 ; also sheet 4
GND [ground]: C17.2 IC2.1(GND_1) IC2.13(GND_2) IC2.28(GNDP) IC2.32(TST_MODE) IC2.33(GND_PAD) J14.1 R7.1 R8.2 ; also sheet 1,2,3,4,5,7,8,9
N$11: Q5.R(S) Q6.R(S) R8.1 R16.1
N$14: Q3.R(S) Q4.R(S) R7.2 R15.1
S1_BMA1: IC2.5(BMA1) J4.2 Q2.C(D) Q4.C(D)
S1_BMA2: IC2.4(BMA2) J4.1 Q1.C(D) Q3.C(D)
S1_BMB1: IC2.20(BMB1) J3.2 Q6.C(D) Q8.C(D)
S1_BMB2: IC2.21(BMB2) J3.1 Q5.C(D) Q7.C(D)
S1_HA1: IC2.2(HA1) Q2.L(G)
S1_HA2: IC2.3(HA2) Q1.L(G)
S1_HB1: IC2.23(HB1) Q8.L(G)
S1_HB2: IC2.22(HB2) Q7.L(G)
S1_LA1: IC2.6(LA1) Q4.L(G)
S1_LA2: IC2.7(LA2) Q3.L(G)
S1_LB1: IC2.19(LB1) Q6.L(G)
S1_LB2: IC2.18(LB2) Q5.L(G)
S1_SRA: IC2.8(SRA) R15.2
S1_SRB: IC2.17(SRB) R16.2
S1_VHS: C18.2 IC2.24(VHS)
SPI_STEPPER_1_SDO: IC2.10(SDO) ; also sheet 7
SPI_STEPPER_CS: IC2.14(!CS!) ; also sheet 4,7,8
SPI_STEPPER_SCK: IC2.12(SCK) ; also sheet 4,7,8
SPI_STEPPER_SDO: IC2.11(SDI) ; also sheet 4
VCC: C17.1 C18.1 IC2.25(VS) Q1.R(S) Q2.R(S) Q7.R(S) Q8.R(S) ; also sheet 3,5,7,8
Unconnected: IC2.9(5V_OUT) IC2.15(!EN) IC2.26(TST_ANA) IC2.27(SG_TST) IC2.30(DIR) IC2.31(STEP)

### Notes on the sheet
- Stepper 1 MOSFETs | Stepper 1 Controller
- Stepper 1 Encoder Input

## Sheet 7 of 9: Stepper 2
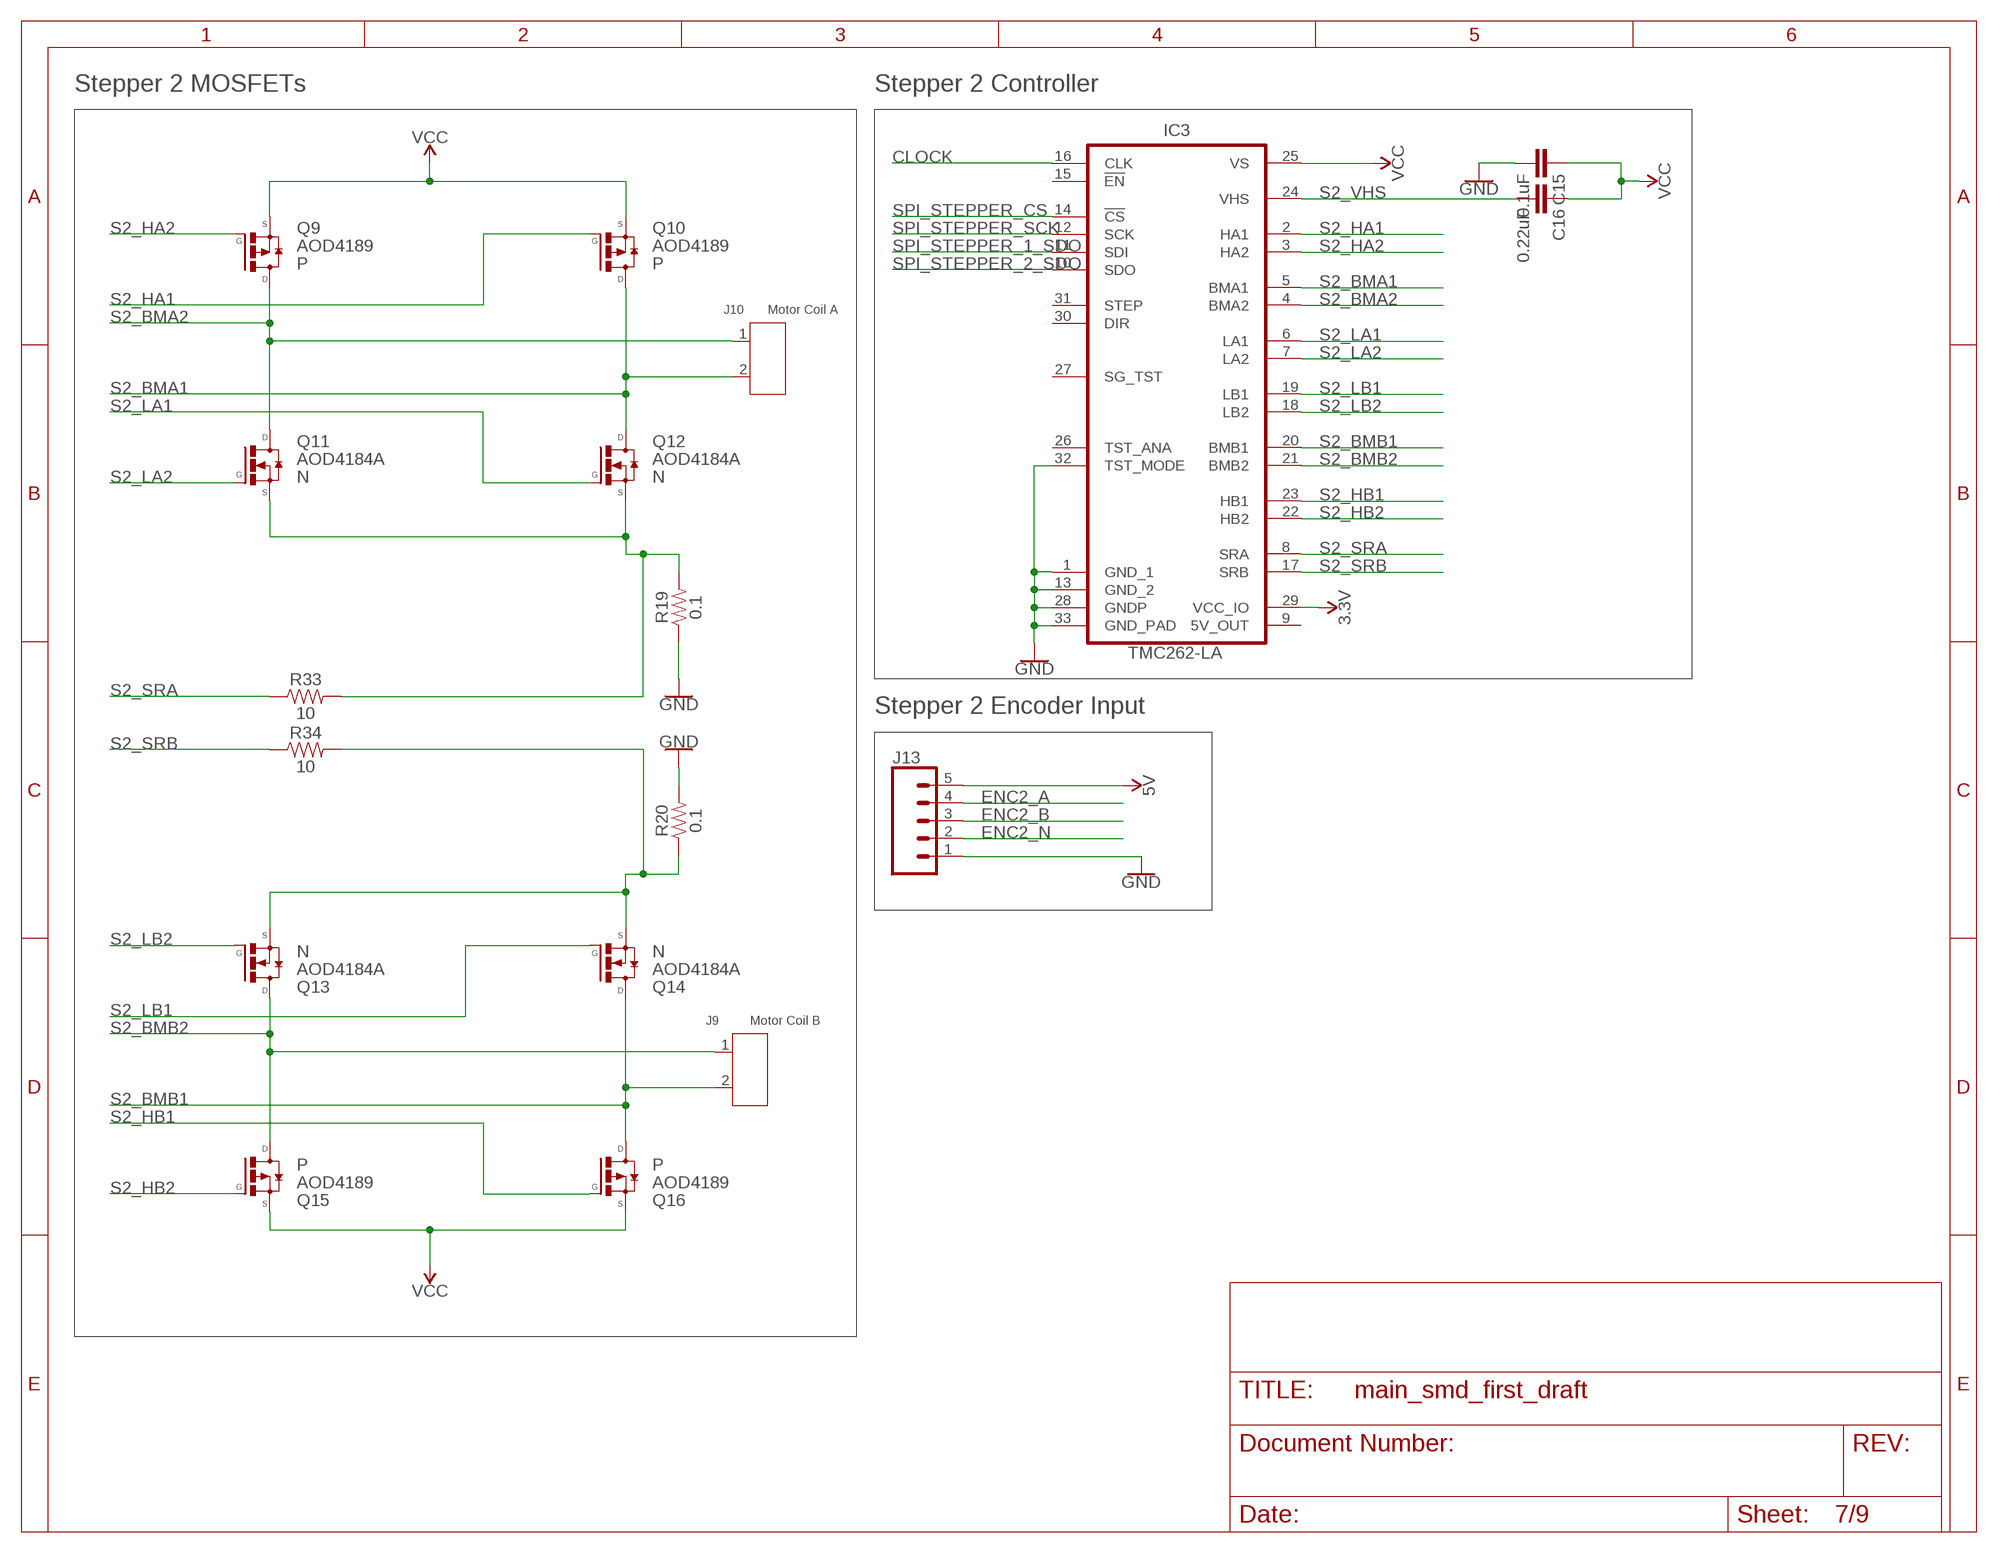
[diagram p6: schematic, sheet 7]

### Parts
C15  0.1uF  0.1UF-0402-16V-10%  [0402]
C16  0.22uF  0.22UF-0603-25V-10%  [0603]
IC3  TMC262-LA  TMC262-LA  [TMC_QFN32_0.5_5.0X5.0]
J9  Motor Coil B  SCREW-TERMINAL-GREEN(2P-5.0)  [H2-5.0-10.5X8.0MM]
J10  Motor Coil A  SCREW-TERMINAL-GREEN(2P-5.0)  [H2-5.0-10.5X8.0MM]
J13  CONN_05  [1X05]
Q9  AOD4189  [TO252]
Q10  AOD4189  [TO252]
Q11  AOD4184A  [TO252]
Q12  AOD4184A  [TO252]
Q13  AOD4184A  [TO252]
Q14  AOD4184A  [TO252]
Q15  AOD4189  [TO252]
Q16  AOD4189  [TO252]
R19  0.1  0.1OHM-1210-1/2W-1%  [1210]
R20  0.1  0.1OHM-1210-1/2W-1%  [1210]
R33  10  10OHM-1206-1/4W-1%  [1206]
R34  10  10OHM-1206-1/4W-1%  [1206]

### Nets
3.3V [power]: IC3.29(VCC_IO) ; also sheet 1,2,3,4,5,6,8,9
5V [power]: J13.5 ; also sheet 1,2,3,5,6,8
CLOCK: IC3.16(CLK) ; also sheet 4,6,8
ENC2_A: J13.4 ; also sheet 4
ENC2_B: J13.3 ; also sheet 4
ENC2_N: J13.2 ; also sheet 4
GND [ground]: C15.2 IC3.1(GND_1) IC3.13(GND_2) IC3.28(GNDP) IC3.32(TST_MODE) IC3.33(GND_PAD) J13.1 R19.1 R20.2 ; also sheet 1,2,3,4,5,6,8,9
N$12: Q11.R(S) Q12.R(S) R19.2 R33.2
N$13: Q13.R(S) Q14.R(S) R20.1 R34.2
S2_BMA1: IC3.5(BMA1) J10.2 Q10.C(D) Q12.C(D)
S2_BMA2: IC3.4(BMA2) J10.1 Q9.C(D) Q11.C(D)
S2_BMB1: IC3.20(BMB1) J9.2 Q14.C(D) Q16.C(D)
S2_BMB2: IC3.21(BMB2) J9.1 Q13.C(D) Q15.C(D)
S2_HA1: IC3.2(HA1) Q10.L(G)
S2_HA2: IC3.3(HA2) Q9.L(G)
S2_HB1: IC3.23(HB1) Q16.L(G)
S2_HB2: IC3.22(HB2) Q15.L(G)
S2_LA1: IC3.6(LA1) Q12.L(G)
S2_LA2: IC3.7(LA2) Q11.L(G)
S2_LB1: IC3.19(LB1) Q14.L(G)
S2_LB2: IC3.18(LB2) Q13.L(G)
S2_SRA: IC3.8(SRA) R33.1
S2_SRB: IC3.17(SRB) R34.1
S2_VHS: C16.2 IC3.24(VHS)
SPI_STEPPER_1_SDO: IC3.11(SDI) ; also sheet 6
SPI_STEPPER_2_SDO: IC3.10(SDO) ; also sheet 8
SPI_STEPPER_CS: IC3.14(!CS!) ; also sheet 4,6,8
SPI_STEPPER_SCK: IC3.12(SCK) ; also sheet 4,6,8
VCC: C15.1 C16.1 IC3.25(VS) Q9.R(S) Q10.R(S) Q15.R(S) Q16.R(S) ; also sheet 3,5,6,8
Unconnected: IC3.9(5V_OUT) IC3.15(!EN) IC3.26(TST_ANA) IC3.27(SG_TST) IC3.30(DIR) IC3.31(STEP)

### Notes on the sheet
- Stepper 2 MOSFETs | Stepper 2 Controller
- Stepper 2 Encoder Input

## Sheet 8 of 9: Stepper 3
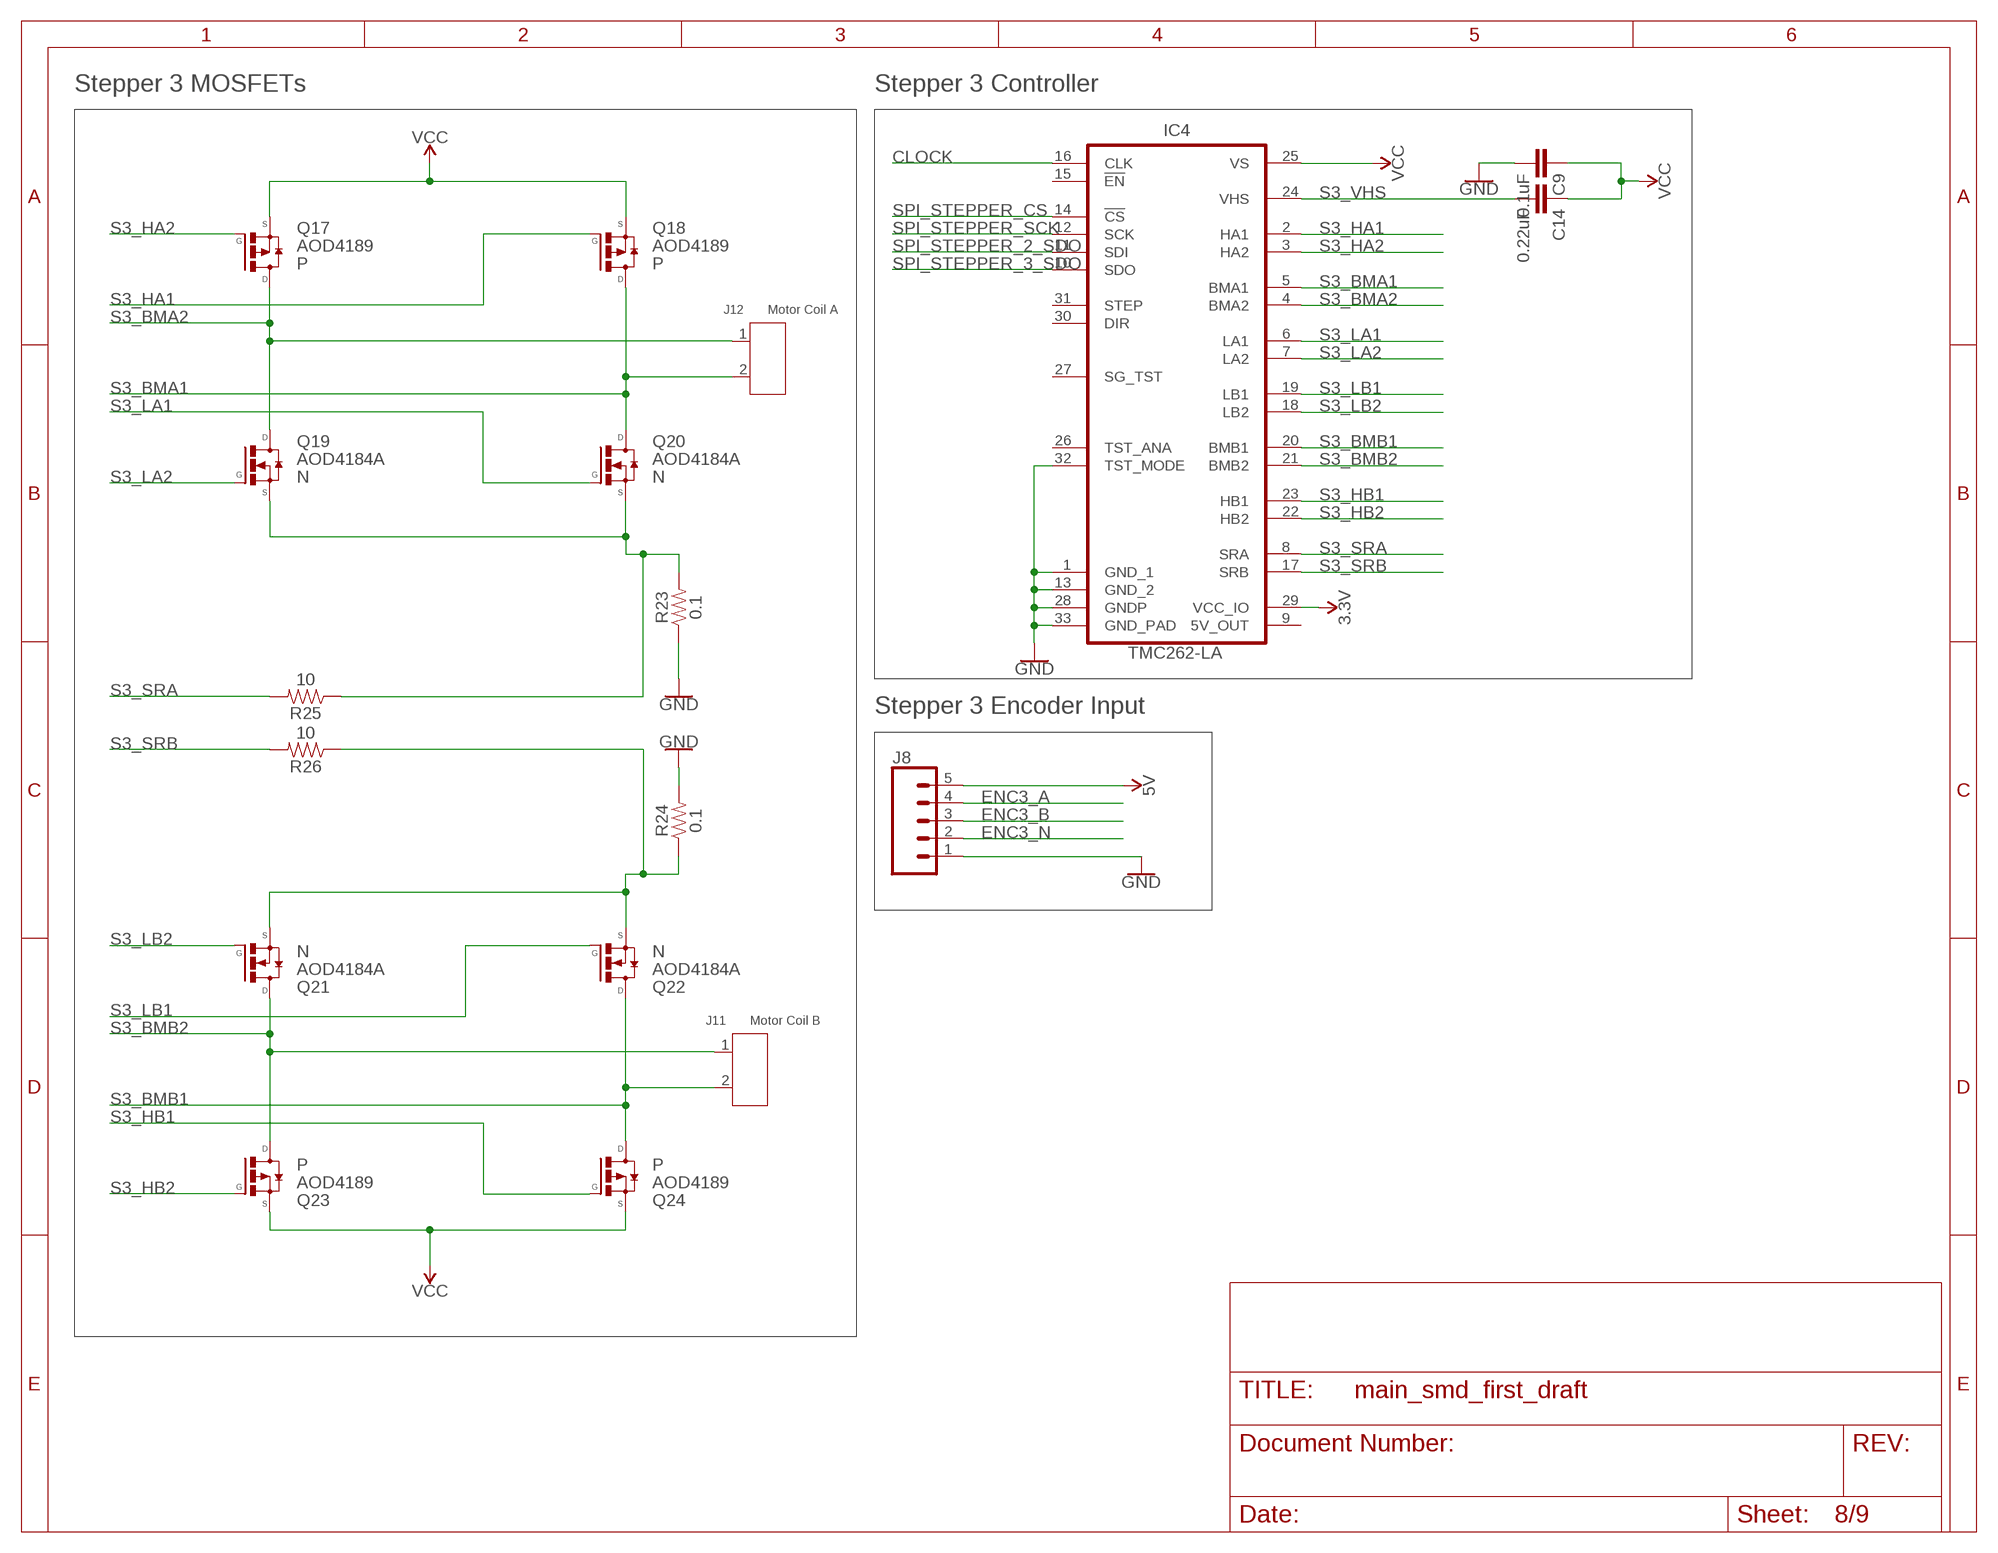
[diagram p7: schematic, sheet 8]

### Parts
C9  0.1uF  0.1UF-0402-16V-10%  [0402]
C14  0.22uF  0.22UF-0603-25V-10%  [0603]
IC4  TMC262-LA  TMC262-LA  [TMC_QFN32_0.5_5.0X5.0]
J8  CONN_05  [1X05]
J11  Motor Coil B  SCREW-TERMINAL-GREEN(2P-5.0)  [H2-5.0-10.5X8.0MM]
J12  Motor Coil A  SCREW-TERMINAL-GREEN(2P-5.0)  [H2-5.0-10.5X8.0MM]
Q17  AOD4189  [TO252]
Q18  AOD4189  [TO252]
Q19  AOD4184A  [TO252]
Q20  AOD4184A  [TO252]
Q21  AOD4184A  [TO252]
Q22  AOD4184A  [TO252]
Q23  AOD4189  [TO252]
Q24  AOD4189  [TO252]
R23  0.1  0.1OHM-1210-1/2W-1%  [1210]
R24  0.1  0.1OHM-1210-1/2W-1%  [1210]
R25  10  10OHM-1206-1/4W-1%  [1206]
R26  10  10OHM-1206-1/4W-1%  [1206]

### Nets
3.3V [power]: IC4.29(VCC_IO) ; also sheet 1,2,3,4,5,6,7,9
5V [power]: J8.5 ; also sheet 1,2,3,5,6,7
CLOCK: IC4.16(CLK) ; also sheet 4,6,7
ENC3_A: J8.4 ; also sheet 4
ENC3_B: J8.3 ; also sheet 4
ENC3_N: J8.2 ; also sheet 4
GND [ground]: C9.2 IC4.1(GND_1) IC4.13(GND_2) IC4.28(GNDP) IC4.32(TST_MODE) IC4.33(GND_PAD) J8.1 R23.1 R24.2 ; also sheet 1,2,3,4,5,6,7,9
N$15: Q19.R(S) Q20.R(S) R23.2 R25.1
N$16: Q21.R(S) Q22.R(S) R24.1 R26.1
S3_BMA1: IC4.5(BMA1) J12.2 Q18.C(D) Q20.C(D)
S3_BMA2: IC4.4(BMA2) J12.1 Q17.C(D) Q19.C(D)
S3_BMB1: IC4.20(BMB1) J11.2 Q22.C(D) Q24.C(D)
S3_BMB2: IC4.21(BMB2) J11.1 Q21.C(D) Q23.C(D)
S3_HA1: IC4.2(HA1) Q18.L(G)
S3_HA2: IC4.3(HA2) Q17.L(G)
S3_HB1: IC4.23(HB1) Q24.L(G)
S3_HB2: IC4.22(HB2) Q23.L(G)
S3_LA1: IC4.6(LA1) Q20.L(G)
S3_LA2: IC4.7(LA2) Q19.L(G)
S3_LB1: IC4.19(LB1) Q22.L(G)
S3_LB2: IC4.18(LB2) Q21.L(G)
S3_SRA: IC4.8(SRA) R25.2
S3_SRB: IC4.17(SRB) R26.2
S3_VHS: C14.2 IC4.24(VHS)
SPI_STEPPER_2_SDO: IC4.11(SDI) ; also sheet 7
SPI_STEPPER_3_SDO: IC4.10(SDO) ; also sheet 4
SPI_STEPPER_CS: IC4.14(!CS!) ; also sheet 4,6,7
SPI_STEPPER_SCK: IC4.12(SCK) ; also sheet 4,6,7
VCC: C9.1 C14.1 IC4.25(VS) Q17.R(S) Q18.R(S) Q23.R(S) Q24.R(S) ; also sheet 3,5,6,7
Unconnected: IC4.9(5V_OUT) IC4.15(!EN) IC4.26(TST_ANA) IC4.27(SG_TST) IC4.30(DIR) IC4.31(STEP)

### Notes on the sheet
- Stepper 3 MOSFETs | Stepper 3 Controller
- Stepper 3 Encoder Input

## Sheet 9 of 9: GPS, IMU
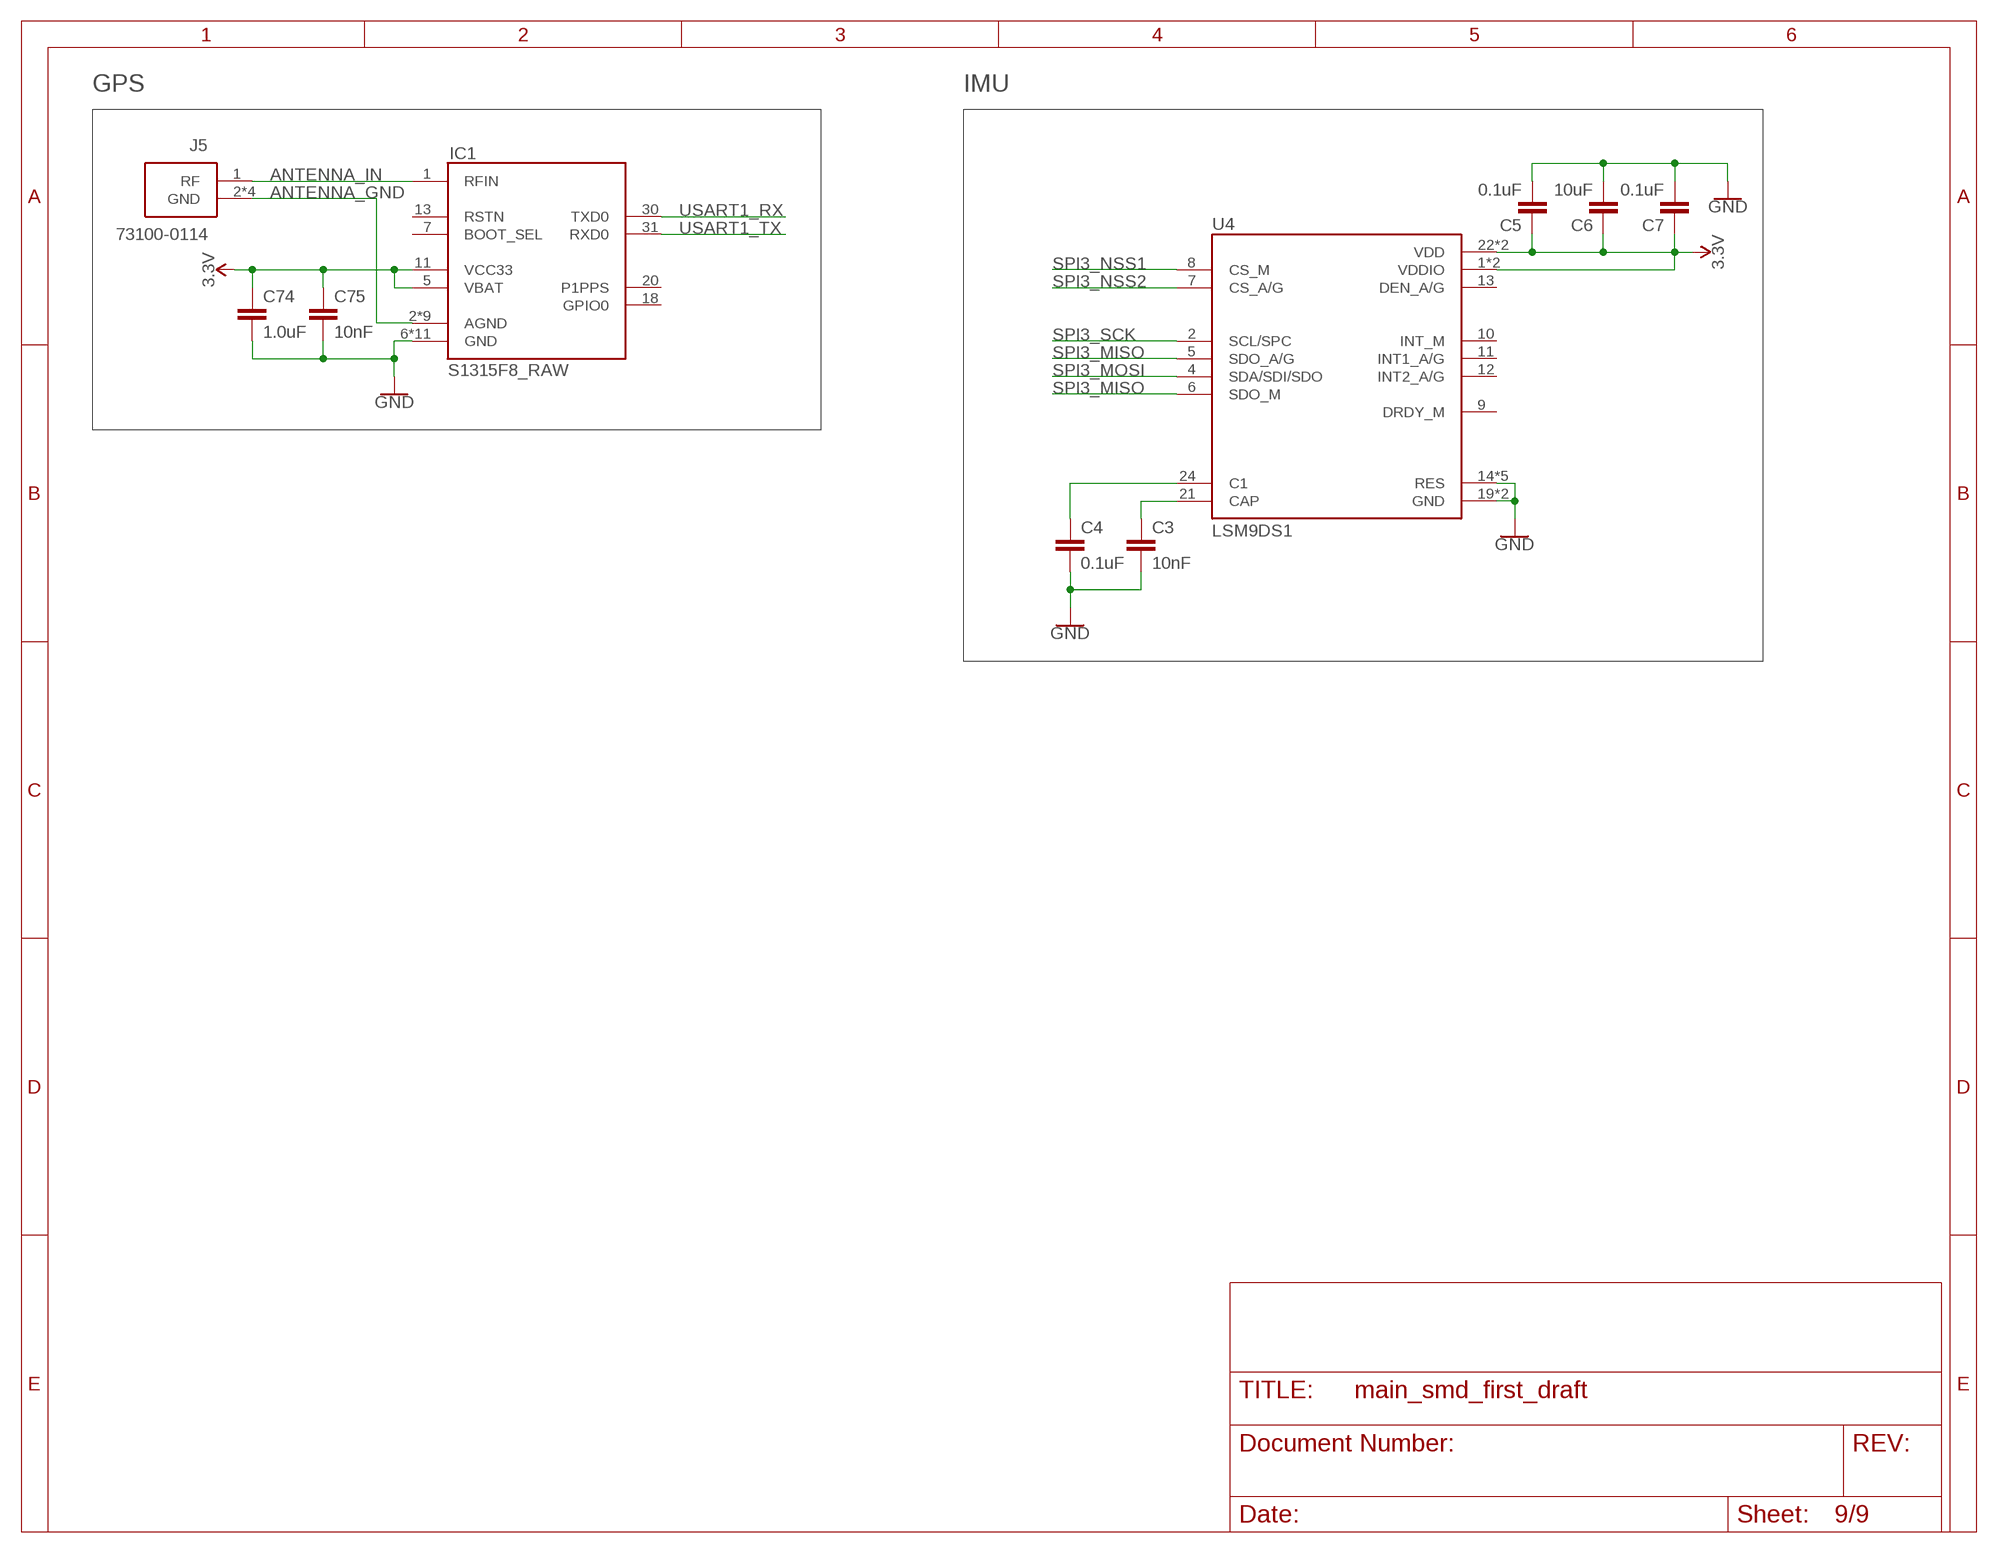
[diagram p8: schematic, sheet 9]

### Parts
C3  10nF  10NF-0603-50V-10%  [0603]
C4  0.1uF  0.1UF-0402-16V-10%  [0402]
C5  0.1uF  0.1UF-0402-16V-10%  [0402]
C6  10uF  10UF-0603-6.3V-20%  [0603]
C7  0.1uF  0.1UF-0402-16V-10%  [0402]
C74  1.0uF  1.0UF-0402-16V-10%  [0402]
C75  10nF  10NF-0603-50V-10%  [0603]
IC1  S1315F8_RAW  [S1315F8_SMT]
J5  73100-0114  [73100-0114]
U4  LSM9DS1  [PQFN24P43_350X300X102L35X23N]

### Nets
3.3V [power]: C5.1 C6.1 C7.1 C74.1 C75.1 IC1.5(VBAT) IC1.11(VCC33) U4.1(VDDIO) U4.3(VDDIO) U4.22(VDD) U4.23(VDD) ; also sheet 1,2,3,4,5,6,7,8
ANTENNA_GND [rf_gnd]: IC1.2(AGND) IC1.3(AGND) IC1.4(AGND) IC1.26(AGND) IC1.28(AGND) IC1.29(AGND) IC1.33(AGND) IC1.35(AGND) IC1.36(AGND) J5.2(GND) J5.3(GND) J5.4(GND) J5.5(GND)
ANTENNA_IN [rf]: IC1.1(RFIN) J5.1(RF)
GND [ground]: C3.2 C4.2 C5.2 C6.2 C7.2 C74.2 C75.2 IC1.6(GND) IC1.9(GND) IC1.10(GND) IC1.12(GND) IC1.15(GND) IC1.17(GND) IC1.19(GND) IC1.21(GND) IC1.22(GND) IC1.23(GND) IC1.24(GND) U4.14(RES) U4.15(RES) U4.16(RES) U4.17(RES) U4.18(RES) U4.19(GND) U4.20(GND) ; also sheet 1,2,3,4,5,6,7,8
N$7: C4.1 U4.24(C1)
N$8: C3.1 U4.21(CAP)
SPI3_MISO: U4.5(SDO_A/G) U4.6(SDO_M) ; also sheet 1
SPI3_MOSI: U4.4(SDA/SDI/SDO) ; also sheet 1
SPI3_NSS1: U4.8(CS_M) ; also sheet 1
SPI3_NSS2: U4.7(CS_A/G) ; also sheet 1
SPI3_SCK: U4.2(SCL/SPC) ; also sheet 1
USART1_RX: IC1.30(TXD0) ; also sheet 1
USART1_TX: IC1.31(RXD0) ; also sheet 1
Unconnected: IC1.7(BOOT_SEL) IC1.13(RSTN) IC1.18(GPIO0) IC1.20(P1PPS) U4.9(DRDY_M) U4.10(INT_M) U4.11(INT1_A/G) U4.12(INT2_A/G) U4.13(DEN_A/G)

### Notes on the sheet
- GPS | IMU

## Library data of the parts
+ - = wirepad:3,81/1,1: THROUGH-HOLE PAD
C1 C39 C41 C43 = SparkFun-Capacitors:0.1UF: 0.1µF ceramic capacitors A capacitor is a passive two-terminal electrical component used to store electrical energy temporarily in an electric field.; PROD_ID: CAP-08390
C2 = SparkFun-Capacitors:1.0UF: 1µF ceramic capacitors A capacitor is a passive two-terminal electrical component used to store electrical energy temporarily in an electric field.; PROD_ID: CAP-00868
C3 C10-C12 C20 C24 C25 C31 C32 C35-C37 C75 = SparkFun-Capacitors:10NF: 0.01uF/10nF/10,000pF ceramic capacitors A capacitor is a passive two-terminal electrical component used to store electrical energy temporarily in an electric field. CAP-09321; PROD_ID: CAP-00867
C4 C5 C7 C9 C15 C17 C26-C29 C50-C52 = SparkFun-Capacitors:0.1UF: 0.1µF ceramic capacitors A capacitor is a passive two-terminal electrical component used to store electrical energy temporarily in an electric field.; PROD_ID: CAP-12416
C6 = SparkFun-Capacitors:10UF: 10.0µF ceramic capacitors A capacitor is a passive two-terminal electrical component used to store electrical energy temporarily in an electric field.; PROD_ID: CAP-11015
C8 = SparkFun-Capacitors:470NF: 0.47uF/470nF ceramic capacitors A capacitor is a passive two-terminal electrical component used to store electrical energy temporarily in an electric field.; PROD_ID: CAP-09041
C13 C38 C40 C42 C65 C70 = SparkFun-Capacitors:10UF: 10.0µF ceramic capacitors A capacitor is a passive two-terminal electrical component used to store electrical energy temporarily in an electric field.; PROD_ID: CAP-09824
C14 C16 C18 C73 = SparkFun-Capacitors:0.22UF: 0.22µF ceramic capacitors A capacitor is a passive two-terminal electrical component used to store electrical energy temporarily in an electric field.; PROD_ID: CAP-07822
C19 C64 C66-C68 = SparkFun-Capacitors:1.0UF: 1µF ceramic capacitors A capacitor is a passive two-terminal electrical component used to store electrical energy temporarily in an electric field.; PROD_ID: CAP-09822
C21 = rcl:C-EU: CAPACITOR, European symbol; SPICEPREFIX: C
C22 C23 = resistor:CPOL-US: POLARIZED CAPACITOR, American symbol
C30 = SparkFun-Capacitors:4.7UF: 4.7µF ceramic capacitors A capacitor is a passive two-terminal electrical component used to store electrical energy temporarily in an electric field.; PROD_ID: CAP-08280
C33 C34 = SparkFun-Capacitors:0.1UF: 0.1µF ceramic capacitors A capacitor is a passive two-terminal electrical component used to store electrical energy temporarily in an electric field.; PROD_ID: CAP-00810
C44-C49 C69 = SparkFun-Capacitors:22UF: 22µF ceramic capacitors A capacitor is a passive two-terminal electrical component used to store electrical energy temporarily in an electric field.
C53-C58 C62 C63 = resistor:C-EU: CAPACITOR, European symbol
C59-C61 C71 C72 = SparkFun-Capacitors:0.1UF: 0.1µF ceramic capacitors A capacitor is a passive two-terminal electrical component used to store electrical energy temporarily in an electric field.; PROD_ID: CAP-08604
C74 = SparkFun-Capacitors:1.0UF: 1µF ceramic capacitors A capacitor is a passive two-terminal electrical component used to store electrical energy temporarily in an electric field.; PROD_ID: CAP-12417
D1 = diode:MBRS3*0T3: SCHOTTKY BARRIER RECTIFIER 3.0 AMPERES 20, 30, 40 VOLT Source: MBRS340T3-D.pdf
D2 D3 = diode:1N4004: DIODE general purpose rectifier, 1 A
FB1 = SparkFun-Coils:FERRITE_BEAD: Ferrite Bead (blocks, cores, rings, chokes, etc.) Inductor with layers of ferrite used to suppress high frequencies. Often used to isolate high frequency noise. SparkFun Products: IOIO-OTG - V2.2 <https://www.sparkfun.com/products/13613> SparkFun SAMD21 Mini Breakout <https://www.sparkfun.com/products/13664> SparkFun 6 Degrees of Freedom Breakout - LSM6DS3 <https://www.sparkfun.com/products/13339> SparkFun SAMD21 Dev Breakout <https://www.sparkfun.com/products/13672>; PROD_ID: NDUC-07859
FOCUS SHUTTER = Mel_Custom:4N35S
IC0 = Mel_Custom:STM32F313VCT6
IC1 = S1315F_RAW:S1315F8_RAW
IC2-IC4 = TMC262-LA:TMC262-LA: Energy saving high resolution microstepping two phase stepper driver with Step/Dir, SPI, up to 60V, QFN32(5x5); DATASHEET: http://www_trinamic_com/_scripts/download_php?file=_articles%2Fproducts%2Fintegrated-circuits%2Ftmc262%2F_datasheet%2FTMC262_datasheet_pdf; DESCRIPTION: Energy saving high resolution microstepping two phase stepper driver with Step/Dir, SPI, up to 60V, QFN32(5x5); DISTRIBUTOR1: Digikey; DISTRIBUTOR2: Farnell; GEOMETRY_HEIGHT: 0,9mm; MANUFACTURER: TRINAMIC; ORDERCODE-DISTRI1: 1460-1044-ND; ORDERCODE-DISTRI2: 1858307; ORDERCODE-MANU1: TMC262-LA
IC5 = TMC424:TMC424: Serial triple Incremental Encoder Interface; TQ100; DATASHEET: http://www_trinamic_com/_scripts/download_php?file=_articles%2Fproducts%2Fintegrated-circuits%2Ftmc424%2F_datasheet%2FTMC424_datasheet_pdf; DESCRIPTION: Serial triple Incremental Encoder Interface; TQ100; DISTRIBUTOR1: Digikey; DISTRIBUTOR2: Farnell; GEOMETRY_HEIGHT: 1_6mm; MANUFACTURER: TRINAMIC; ORDERCODE-DISTRI1: 1460-1046-ND; ORDERCODE-MANU1: TMC424
IC6 = TMC429-PI24:TMC429-PI24: Intelligent Triple Stepper Motor Controller with SPI, Step/Dir, SOP24; DATASHEET: http://www_trinamic_com/_scripts/download_php?file=_articles%2Fproducts%2Fintegrated-circuits%2Ftmc429%2F_datasheet%2FTMC429_datasheet_pdf; DESCRIPTION: Intelligent Triple Stepper Motor Controller with SPI, Step/Dir, SOP24; DISTRIBUTOR1: Digikey; DISTRIBUTOR2: Farnell; GEOMETRY_HEIGHT: 2,65mm; MANUFACTURER: TRINAMIC; ORDERCODE-DISTRI1: 1460-1058-5-ND; ORDERCODE-DISTRI2: 1858309; ORDERCODE-MANU1: TMC429-PI24
IC8 = v-reg:LM317?*: 500 mA Adjustable Output Positive Voltage Regulator Source: http://www.onsemi.co.jp .. LM317M-D.PDF; PARTNUMBER: LM317M
J1 = SparkFun-Connectors:POWER_JACK: Power Jack Connector This is the standard 5.5mm barrel jack for power. The PTH is the most common, proven, reliable, footprint. The Slot footprint only works if the mill layer is transmitted to the PCB fab house so be warned. Here are the connectors we sell at SparkFun: DC Barrel Power Jack/Connector <https://www.sparkfun.com/products/119> (PRT-00119) DC Barrel Power Jack/Connector (SMD) <https://www.sparkfun.com/products/12748> (PRT-12748) DC Barrel Jack Adapter - Breadboard Compatible <https://www.sparkfun.com/products/10811> (PRT-10811) It is used on this SparkFun product (and many, many others): SparkFun RedBoard - Programmed with Arduino <https://www.sparkfun.com/products/12757> (DEV-12757) Also, if you need a mating power supply or connector, please check these out: Wall Adapter Power Supply - 9VDC 650mA <https://www.sparkfun.com/products/298> (TOL-00298) DC Barrel Jack Adapter - Male <https://www.sparkfun.com/products/10287> (PRT-10287); PROD_ID: PRT-10811
J2 = SparkFun-Connectors:CONN_05X2: Multi connection point. Often used as Generic Header-pin footprint for 0.1 inch spaced/style header connections For AVR SPI programming port, see special device with nice symbol: "AVR_SPI_PROG_5x2.dev" You can populate with any combo of single row headers, but if you'd like an exact match, check these: 2x5 AVR ICSP Male Header <https://www.sparkfun.com/products/778> (PRT-00778) 2x5 Pin Shrouded Header <https://www.sparkfun.com/products/8506> (PRT-08506) On any of the 0.1 inch spaced packages, you can populate with these: Break Away Headers - Straight <https://www.sparkfun.com/products/116> (PRT-00116) Break Away Male Headers - Right Angle <https://www.sparkfun.com/products/553> (PRT-00553) Female Headers <https://www.sparkfun.com/products/115> (PRT-00115) Break Away Headers - Machine Pin <https://www.sparkfun.com/products/117> (PRT-00117) Break Away Female Headers - Swiss Machine Pin <https://www.sparkfun.com/products/743> (PRT-00743) Special note: the shrouded connector mates well with our 5x2 ribbon cables: 2x5 Pin IDC Ribbon Cable <https://www.sparkfun.com/products/8535> (PRT-08535); PROD_ID: CONN-08671; SF_ID: PRT-08506
J3 J4 J9-J12 = Seeed-Connector:SCREW-TERMINAL-GREEN(2P-5.0): 320110031; VALUE: GREEN-2P-5.0
J5 = 73100-0114:73100-0114: Molex Right Angle 50ohm Source: Datasheet <http://www.molex.com/webdocs/datasheets/pdf/en-us/0731000114_RF_COAX_CONNECTORS.pdf>; ALLIED_NUMBER: 70357943; ALLIED_PRICE/STOCK: http://www.alliedelec.com/molex-incorporated-73100-0114/70357943/; ARROW_PART_NUMBER: 73100-0114; ARROW_PRICE/STOCK: http://uk.rs-online.com/web/p/products/7595252P; DESCRIPTION: Molex Right Angle 50ohm; HEIGHT: mm; MANUFACTURER_NAME: Molex; MANUFACTURER_PART_NUMBER: 73100-0114; RS_PART_NUMBER: 7595252P; RS_PRICE/STOCK: http://uk.rs-online.com/web/p/products/7595252P
J8 J13 J14 = SparkFun-Connectors:CONN_05: Multi connection point. Often used as Generic Header-pin footprint for 0.1 inch spaced/style header connections On any of the 0.1 inch spaced packages, you can populate with these: Break Away Headers - Straight <https://www.sparkfun.com/products/116> (PRT-00116) Break Away Male Headers - Right Angle <https://www.sparkfun.com/products/553> (PRT-00553) Female Headers <https://www.sparkfun.com/products/115> (PRT-00115) Break Away Headers - Machine Pin <https://www.sparkfun.com/products/117> (PRT-00117) Break Away Female Headers - Swiss Machine Pin <https://www.sparkfun.com/products/743> (PRT-00743) For SCREWTERMINALS and SPRING TERMINALS visit here: Screw Terimnals on SparkFun.com <https://www.sparkfun.com/search/results?term=Screw+Terminals> (5mm/3.5mm/2.54mm spacing) This device is also useful as a general connection point to wire up your design to another part of your project. Our various solder wires solder well into these plated through hole pads. Hook-Up Wire - Assortment (Stranded, 22 AWG) <https://www.sparkfun.com/products/11375> (PRT-11375) Hook-Up Wire - Assortment (Solid Core, 22 AWG) <https://www.sparkfun.com/products/11367> (PRT-11367) View the entire wire category on our website here <https://www.sparkfun.com/categories/141> Special notes: Molex polarized connector foot print use with SKU : PRT-08231 with associated crimp pins and housings. 1MM SMD Version SKU: PRT-10208
JP1 = jumper:JP1Q: JUMPER
L3-L5 = Seeed-Inductor:SMD-INDUCTOR-10UH-225MA-10%(0806): 303010042; MPN: LQH2MCN100K02L
P1 = 1-2295018-2:1-2295018-2: Conn USB Type C RCP 12 POS Solder RA SMD 12 Terminal 1 Port T/R; AVAILABILITY: Good; CENTERLINE_PITCH: .5 mm[.019 in]; COMMENT: 1-2295018-2; DESCRIPTION: USB TYPE C, REC OFFSET 0.65MM DUAL SMT; MF: TE Connectivity; MP: 1-2295018-2; NUMBER_OF_POSITIONS: 24; PACKAGE: None; PRICE: 1.70 USD; PRODUCT_TYPE: Connector
Q1 Q2 Q7-Q10 Q15-Q18 Q23 Q24 = Mel_Custom:AOD4189
Q3-Q6 Q11-Q14 Q19-Q22 = Mel_Custom:AOD4184A
R1 = SparkFun-Resistors:100KOHM: 100kΩ resistor A resistor is a passive two-terminal electrical component that implements electrical resistance as a circuit element. Resistors act to reduce current flow, and, at the same time, act to lower voltage levels within circuits. - Wikipedia; PROD_ID: RES-13495
R6 R11-R14 R17 R18 R22 R31 R32 = SparkFun-Resistors:10KOHM: 10kΩ resistor A resistor is a passive two-terminal electrical component that implements electrical resistance as a circuit element. Resistors act to reduce current flow, and, at the same time, act to lower voltage levels within circuits. - Wikipedia; PROD_ID: RES-00824
R7 R8 R19 R20 R23 R24 = SparkFun-Resistors:0.1OHM: 0.1Ω resistor A resistor is a passive two-terminal electrical component that implements electrical resistance as a circuit element. Resistors act to reduce current flow, and, at the same time, act to lower voltage levels within circuits. - Wikipedia; PROD_ID: RES-12374
R9 R10 = SparkFun-Resistors:220OHM: 220Ω resistor A resistor is a passive two-terminal electrical component that implements electrical resistance as a circuit element. Resistors act to reduce current flow, and, at the same time, act to lower voltage levels within circuits. - Wikipedia; PROD_ID: RES-07861
R15 R16 R25 R26 R33 R34 = SparkFun-Resistors:10OHM: 10Ω resistor A resistor is a passive two-terminal electrical component that implements electrical resistance as a circuit element. Resistors act to reduce current flow, and, at the same time, act to lower voltage levels within circuits. - Wikipedia; PROD_ID: RES-08705
R21 R37 R38 = SparkFun-Resistors:1MOHM: 1MΩ resistor A resistor is a passive two-terminal electrical component that implements electrical resistance as a circuit element. Resistors act to reduce current flow, and, at the same time, act to lower voltage levels within circuits. - Wikipedia; PROD_ID: RES-07868
R27 = SparkFun-Resistors:100KOHM: 100kΩ resistor A resistor is a passive two-terminal electrical component that implements electrical resistance as a circuit element. Resistors act to reduce current flow, and, at the same time, act to lower voltage levels within circuits. - Wikipedia; PROD_ID: RES-07828
R28 R42-R50 = SparkFun-Resistors:RESISTOR: Generic Resistor Package
R29 R30 = resistor:R-US_: RESISTOR, American symbol
R39-R41 = SparkFun-Resistors:47KOHM: 47kΩ resistor A resistor is a passive two-terminal electrical component that implements electrical resistance as a circuit element. Resistors act to reduce current flow, and, at the same time, act to lower voltage levels within circuits. - Wikipedia; PROD_ID: RES-07871
R51 = SparkFun-Resistors:15KOHM: 15kΩ resistor A resistor is a passive two-terminal electrical component that implements electrical resistance as a circuit element. Resistors act to reduce current flow, and, at the same time, act to lower voltage levels within circuits. - Wikipedia; PROD_ID: RES-07854
S1 = EN11-HSM1BF20:EN11-HSM1BF20: ENCODER 11MM ROTARY SW TOP ADJ Source: Datasheet <http://www.ttelectronics.com/sites/default/files/download-files/Datasheet_RotaryEncoder_EN11Series.pdf>; ARROW_PART_NUMBER: EN11-HSM1BF20; DESCRIPTION: ENCODER 11MM ROTARY SW TOP ADJ; HEIGHT: 26mm; MANUFACTURER_NAME: TT Electronics/BI Magnetics; MANUFACTURER_PART_NUMBER: EN11-HSM1BF20
S2 = Common-Parts-Library-Eagle:TL3342F160QG: TL3342 Series SPST 1.6 N Round Button Gull Wing Surface Mount Tactile Switch; MANUFACTURER: E SWITCH
SCREEN1 = Mel_Custom:OLED
U1 = TPD8S300_RUK_20:TPD8S300RUKR
U2 = Common-Parts-Library-Eagle:FT232RL-REEL: USB Full Speed to Serial UART IC, Includes Oscillator and EEPROM - SSOP-28; MANUFACTURER: Future Technology Devices International Ltd
U3 = CDCS502PWR:CDCS502PWR: Crystal Oscillator; AVAILABILITY: Good; DESCRIPTION: Crystal Oscillator / Clock Generator with optional SSC 8-TSSOP -40 to 85; MF: Texas Instruments; MP: CDCS502PWR; PACKAGE: TSSOP-8 Texas Instruments; PRICE: 1.60 USD
U4 = LSM9DS1:LSM9DS1: iNEMO inertial module: 3D accelerometer, 3D gyroscope, 3D magnetometer; AVAILABILITY: Unavailable; DESCRIPTION: iNEMO inertial module: 3D accelerometer, 3D gyroscope, 3D magnetometer; MF: STMicroelectronics; MP: LSM9DS1; PACKAGE: None; PRICE: None
U5-U7 = TPS54336A_DRC_10:TPS54336ADRCR
U$3 = Mel_Custom:BATTERY
U$4 = Mel_Custom:BATTERY_MANAGEMENT_SYSTEM
U$27 U$28 = CSD17309Q3:CSD17309Q3; MANUFACTURER_PART_NUMBER: CSD17309Q3; VENDOR: Texas Instruments
U$29 = TPS65982:TPS659821
X1 = adafruit:STEREOJACK: MIC/HEADPHONE JACK Stereo jack with two switches. Kycon STX3100, CUI SJ1-3555NG and/or 4UCon 05544
Y1 = Common-Parts-Library-Eagle:7B-16.000MAAJ-T: Crystal 16.0000mhz 18pf Smd; MANUFACTURER: TXC Corporation

## Net classes
1 differential: width 0.254 mm
2 ground: width 0.254 mm
3 power: width 0.254 mm
4 rf: width 0.787 mm, clearance 0.152 mm
5 rf_gnd: width 1.575 mm, clearance 0.152 mm